# Altium project TMDX654GPEVM.PrjPcb (part 10 of 24)

## Sheet 26-XDS110 DEBUGGER.SchDoc
size 513 x 386 mm
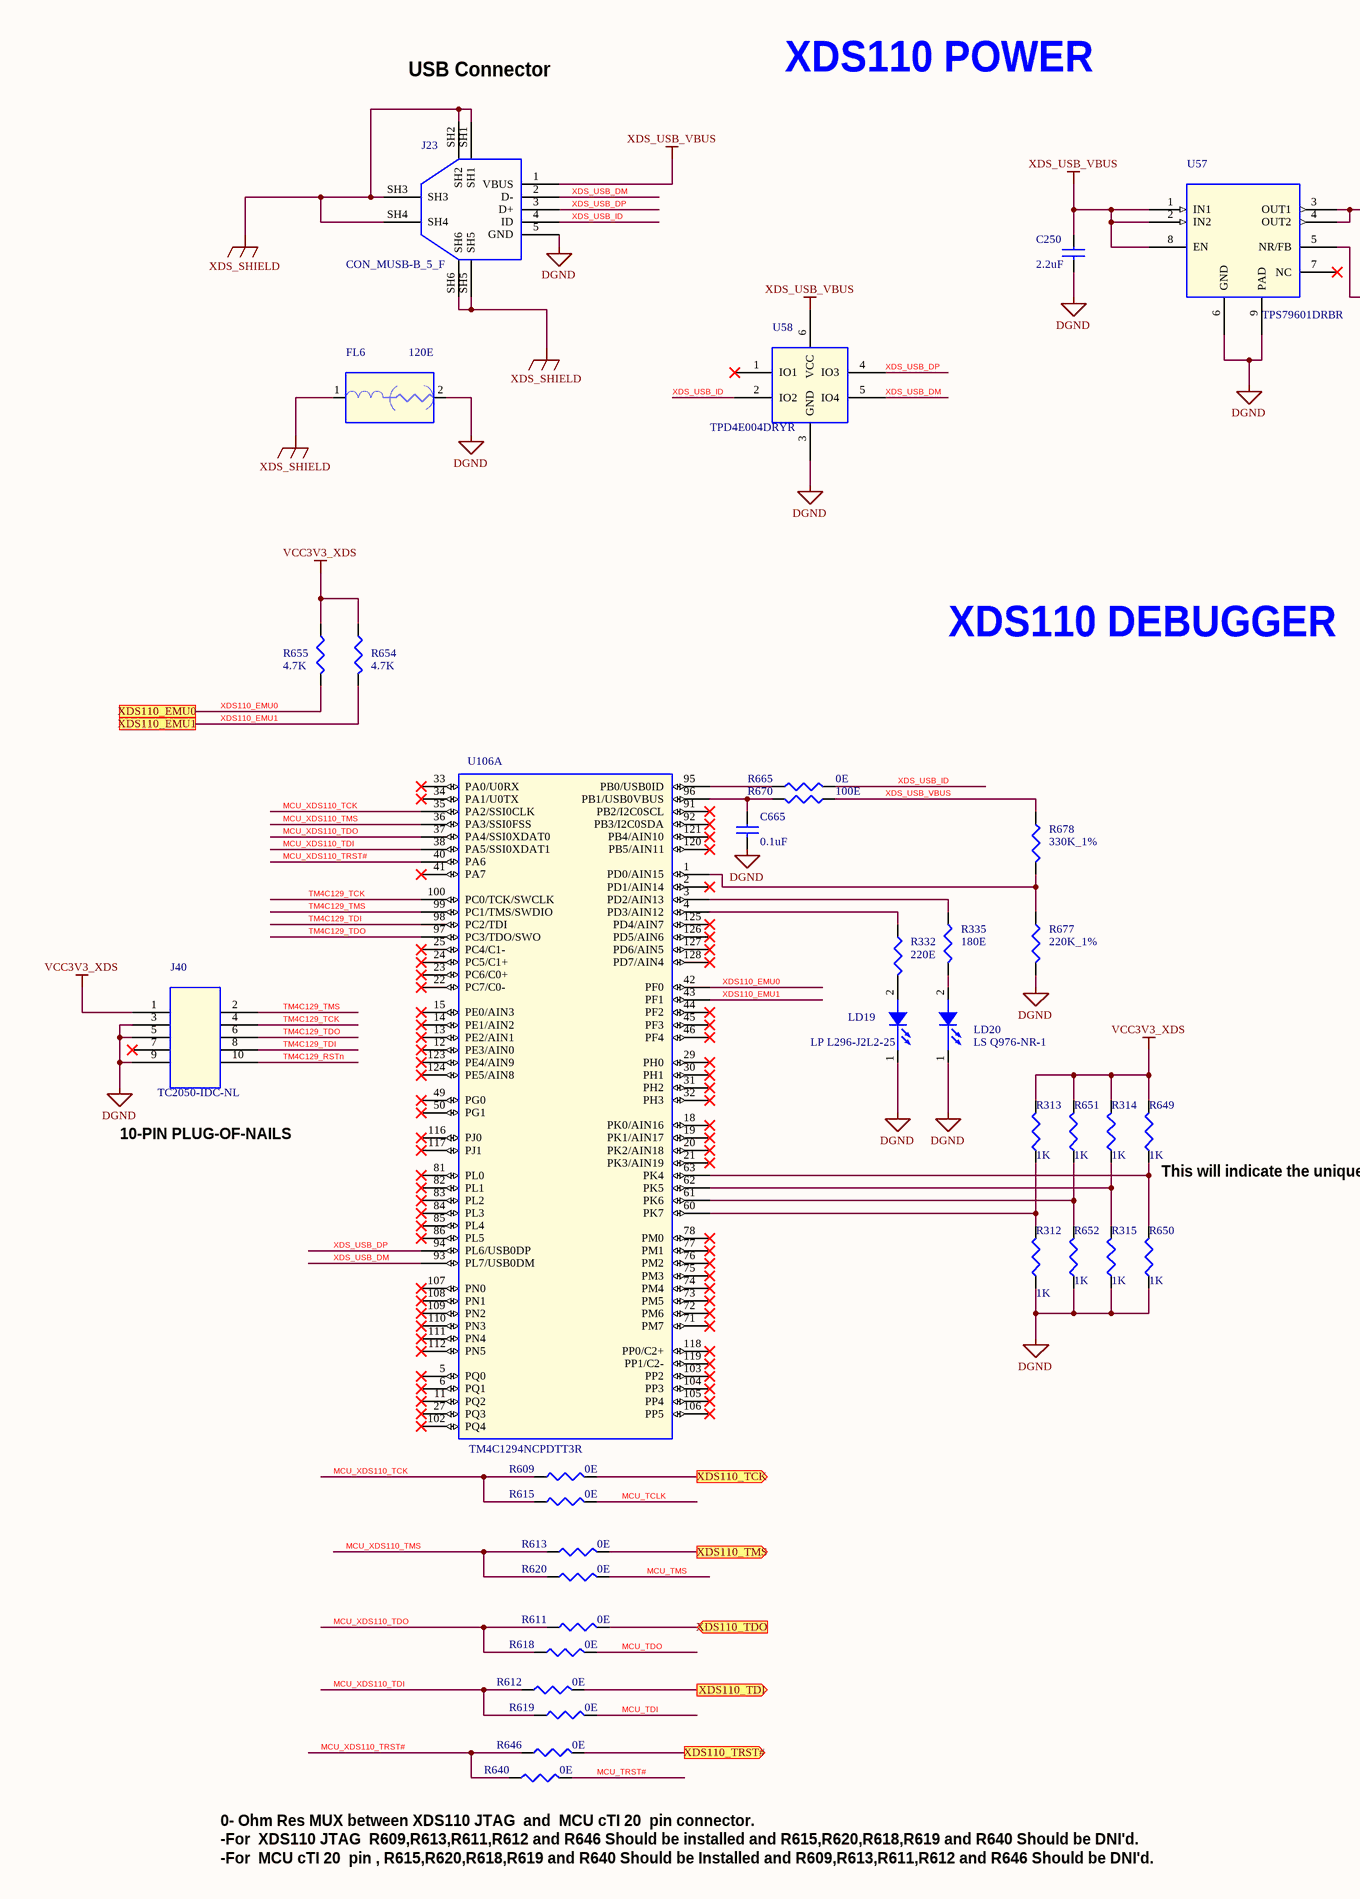
[diagram p44: 26-XDS110 DEBUGGER.SchDoc, left]
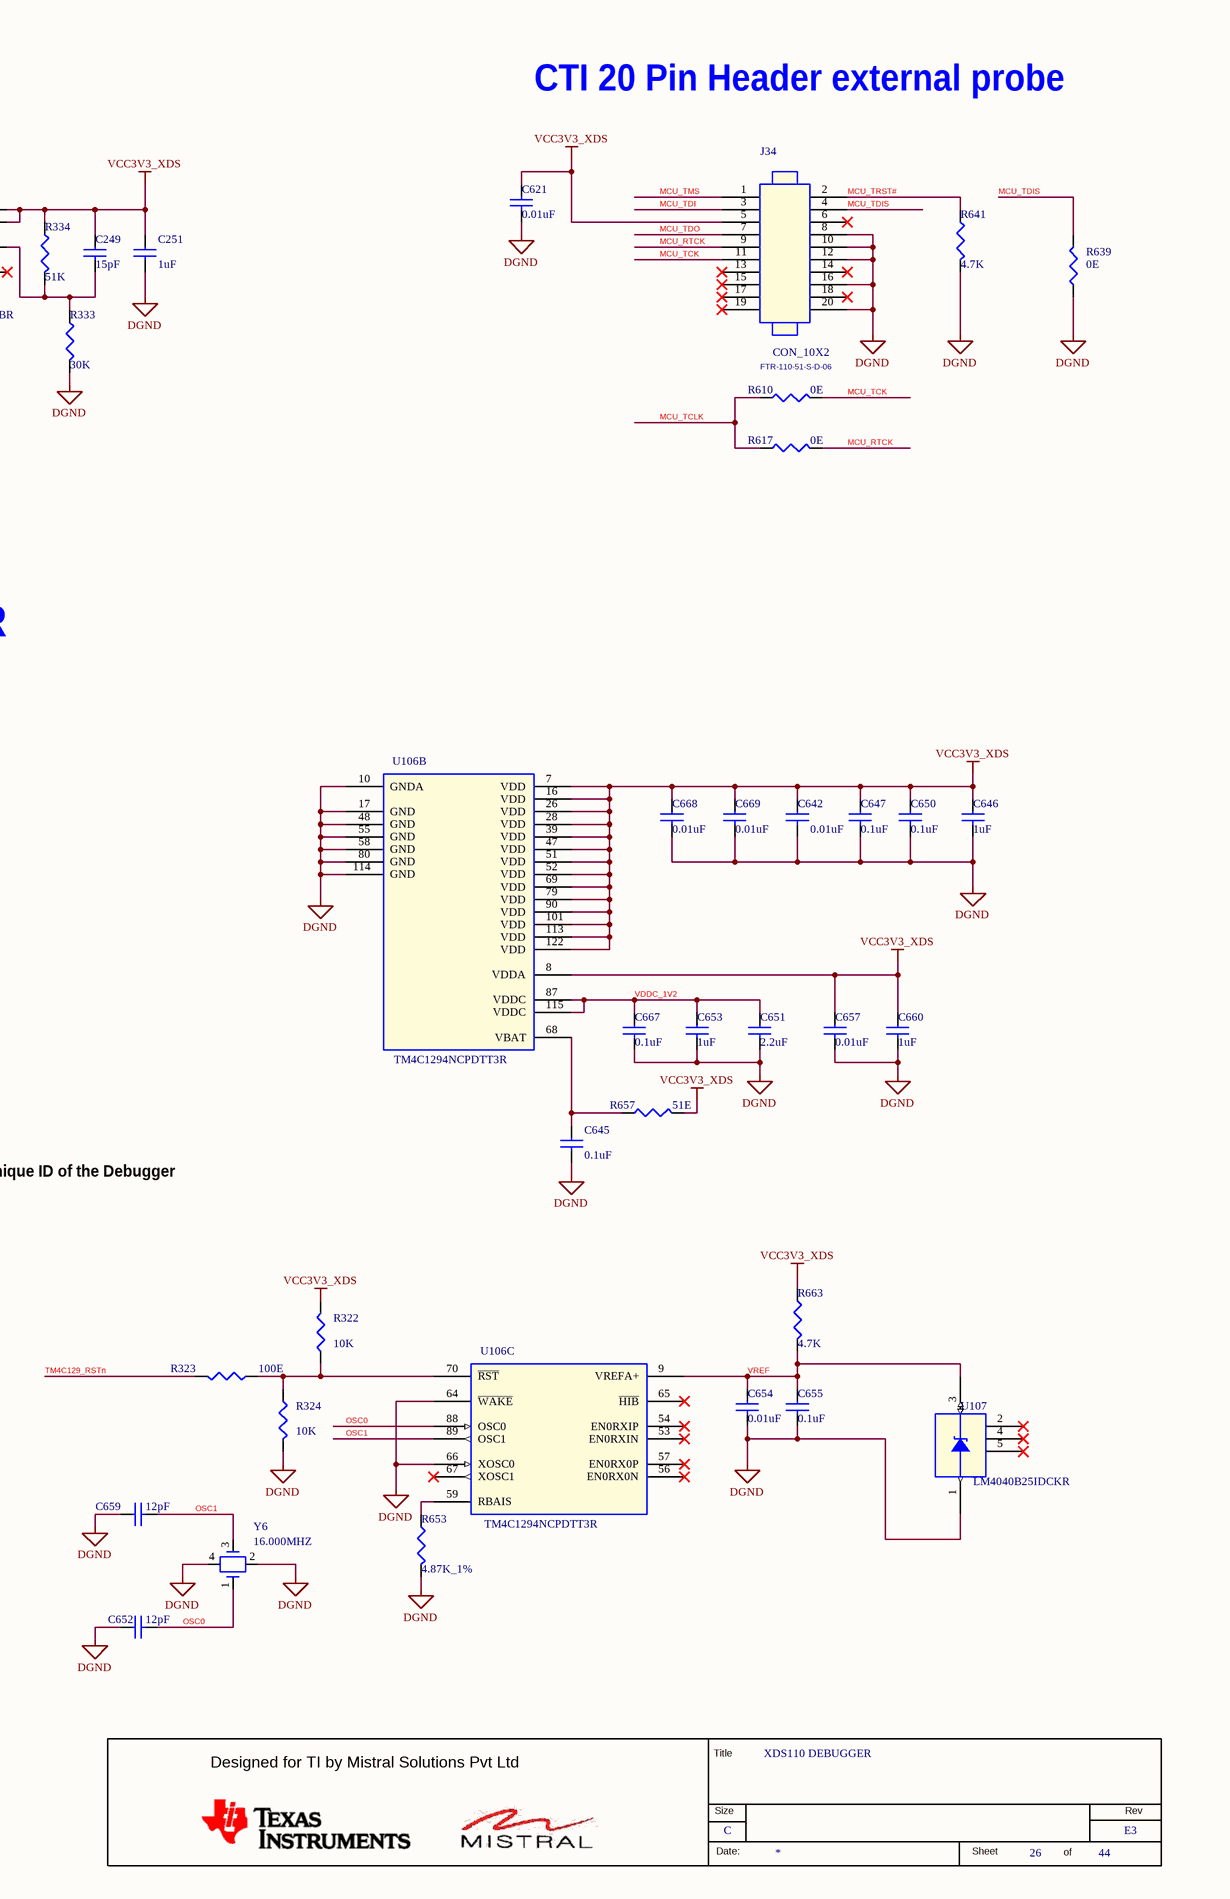
[diagram p45: 26-XDS110 DEBUGGER.SchDoc, right]

### Parts
(Parts that share a designator on the sheet are numbered #1, #2 ... from top to bottom, then left to right.)
*#26  RevCode: E3  Title: XDS110 DEBUGGER  Page Size: C  Page Number: 26  Page Count: 44  (hidden comment: MISTRAL_TITLEBLK_CSIZE)  (graphical)
C249  15pF  [CAP0402_0-75]
C250  2.2uF  [CAP0402_0-75]
C251  1uF  [CAP0402_0-75]
C621  0.01uF  [CAP0201_0-5]
C642  0.01uF  [CAP0201_0-5]
C645  0.1uF  [CAP0201_0-5]
C646  1uF  [CAP0402_0-75]
C647  0.1uF  [CAP0201_0-5]
C650  0.1uF  [CAP0201_0-5]
C651  2.2uF  [CAP0402_0-75]
C652  12pF  [CAP0402]
C653  1uF  [CAP0402_0-75]
C654  0.01uF  [CAP0201_0-5]
C655  0.1uF  [CAP0201_0-5]
C657  0.01uF  [CAP0201_0-5]
C659  12pF  [CAP0402]
C660  1uF  [CAP0402_0-75]
C665  0.1uF  [CAP0201_0-5]
C667  0.1uF  [CAP0201_0-5]
C668  0.01uF  [CAP0201_0-5]
C669  0.01uF  [CAP0201_0-5]
FL6  120E  [EMIFIL_BLM15A_0402_0-6]
J23  CON_MUSB-B_5_F  [CON_MUSBB5_1051640001_S_R_S_2-5]
J34  CON_10X2  Mfr_part_number: FTR-110-51-S-D-06  [CON_10X2_FTR-110-51-S-D_P_S_S]
J40  TC2050-IDC-NL  [CON_2X5_TC2050-IDC-430-NL_T]
LD19  LP L296-J2L2-25  [LED_0603_0-7]
LD20  LS Q976-NR-1  [LED_0603_0-8]
R312  1K  [RES0201]
R313  1K  [RES0201]
R314  1K  [RES0201]
R315  1K  [RES0201]
R322  10K  [RES0402_0-5]
R323  100E  [RES0402_0-5]
R324  10K  [RES0402_0-5]
R332  220E  [RES0402_0-5]
R333  30K  [RES0402_0-5]
R334  51K  [RES0402_0-5]
R335  180E  [RES0402]
R609  0E  [RES0402_0-5]
R610  0E  [RES0402_0-5]
R611  0E  [RES0402_0-5]
R612  0E  [RES0402_0-5]
R613  0E  [RES0402_0-5]
R615  0E  [RES0402_0-5]
R617  0E  [RES0402_0-5]
R618  0E  [RES0402_0-5]
R619  0E  [RES0402_0-5]
R620  0E  [RES0402_0-5]
R639  0E  [RES0402_0-5]
R640  0E  [RES0402_0-5]
R641  4.7K  [RES0402]
R646  0E  [RES0402_0-5]
R649  1K  [RES0201]
R650  1K  [RES0201]
R651  1K  [RES0201]
R652  1K  [RES0201]
R653  4.87K_1%  [RES0402]
R654  4.7K  [RES0402]
R655  4.7K  [RES0402]
R657  51E  [RES0402]
R663  4.7K  [RES0402]
R665  0E  [RES0402_0-5]
R670  100E  [RES0402_0-5]
R677  220K_1%  [RES0402_0-5]
R678  330K_1%  [RES0402_0-5]
U57  TPS79601DRBR  [SON8_25-59_130X130_1]
U58  TPD4E004DRYR  [SON6_19-68_60X45]
U106  TM4C1294NCPDTT3R  [TQFP128_15-74_550X550_1-2]  (parts A,B,C of 3)
U107  LM4040B25IDCKR  [SC70-5_1-1]
Y6  16.000MHZ  [XTAL4_NX3225GA_130X100_SMD_0-9]

### Ports
XDS110_EMU0, XDS110_EMU1, XDS110_TCK (out), XDS110_TDI (out), XDS110_TDO (in), XDS110_TMS (out), XDS110_TRST# (out)

### Nets
DGND: C250.2 C251.2 C621.2 C642.2 C645.2 C646.2 C647.2 C650.2 C651.2 C652.1 C653.2 C654.2 C655.2 C657.2 C659.1 C660.2 C665.2 C667.2 C668.2 C669.2 FL6.2 J23.5(GND) J34.8 J34.10 J34.12 J34.16 J34.20 J40.3 J40.5 J40.9 LD19.1(CATHODE) LD20.1(CATHODE) R312.1 R315.1 R324.2 R333.2 R639.1 R641.2 R650.1 R652.1 R653.2 R677.2 U57.6(GND) U57.9(PAD) U58.3(GND) U106.10(GNDA) U106.17(GND) U106.48(GND) U106.55(GND) U106.58(GND) U106.64(~{WAKE}) U106.66(XOSC0) U106.80(GND) U106.114(GND) U107.1(ANODE) Y6.2 Y6.4
VCC3V3_XDS: C249.1 C251.1 C621.1 C642.1 C646.1 C647.1 C650.1 C657.1 C660.1 C668.1 C669.1 J34.5 J40.1 R313.2 R314.2 R322.2 R334.1 R649.2 R651.2 R654.1 R655.1 R657.2 R663.1 U57.3(OUT1) U57.4(OUT2) U106.7(VDD) U106.8(VDDA) U106.16(VDD) U106.26(VDD) U106.28(VDD) U106.39(VDD) U106.47(VDD) U106.51(VDD) U106.52(VDD) U106.69(VDD) U106.79(VDD) U106.90(VDD) U106.101(VDD) U106.113(VDD) U106.122(VDD)
XDS_SHIELD: FL6.1 J23.SH1 J23.SH2 J23.SH3 J23.SH4 J23.SH5 J23.SH6
XDS_USB_VBUS: C250.1 J23.1(VBUS) R670.1 R678.1 U57.1(IN1) U57.2(IN2) U57.8(EN) U58.6(VCC)
MCU_RTCK: J34.9 R617.2
MCU_TCK: J34.11 R610.2
MCU_TCLK: R610.1 R615.2 R617.1
MCU_TDI: J34.3 R619.2
MCU_TDIS: J34.4 R639.2
MCU_TDO: J34.7 R618.2
MCU_TMS: J34.1 R620.2
MCU_TRST#: J34.2 R640.2 R641.1
MCU_XDS110_TCK: R609.1 R615.1 U106.35(PA2/SSI0CLK)
MCU_XDS110_TDI: R612.1 R619.1 U106.38(PA5/SSI0XDAT1)
MCU_XDS110_TDO: R611.1 R618.1 U106.37(PA4/SSI0XDAT0)
MCU_XDS110_TMS: R613.1 R620.1 U106.36(PA3/SSI0FSS)
MCU_XDS110_TRST#: R640.1 R646.1 U106.40(PA6)
OSC0: C652.2 U106.88(OSC0) Y6.1
OSC1: C659.2 U106.89(OSC1) Y6.3
TM4C129_RSTn: J40.10 R323.2
TM4C129_TCK: J40.4 U106.100(PC0/TCK/SWCLK)
TM4C129_TDI: J40.8 U106.98(PC2/TDI)
TM4C129_TDO: J40.6 U106.97(PC3/TDO/SWO)
TM4C129_TMS: J40.2 U106.99(PC1/TMS/SWDIO)
VDDC_1V2: C651.1 C653.1 C667.1 U106.87(VDDC) U106.115(VDDC)
VREF: C654.1 C655.1 R663.2 U106.9(VREFA+) U107.3(CATHODE)
XDS110_EMU0: R655.2 U106.42(PF0) ; port XDS110_EMU0
XDS110_EMU1: R654.2 U106.43(PF1) ; port XDS110_EMU1
XDS110_TCK: R609.2 ; port XDS110_TCK
XDS110_TDI: R612.2 ; port XDS110_TDI
XDS110_TDO: R611.2 ; port XDS110_TDO
XDS110_TMS: R613.2 ; port XDS110_TMS
XDS110_TRST#: R646.2 ; port XDS110_TRST#
XDS_USB_DM: J23.2(D-) U58.5(IO4) U106.93(PL7/USB0DM)
XDS_USB_DP: J23.3(D+) U58.4(IO3) U106.94(PL6/USB0DP)
XDS_USB_ID: J23.4(ID) R665.2 U58.2(IO2)
NetC249_2: C249.2 R333.1 R334.2 U57.5(NR/FB)
NetC645_1: C645.1 R657.1 U106.68(VBAT)
NetC665_1: C665.1 R670.2 U106.96(PB1/USB0VBUS)
NetLD19_2: LD19.2(ANODE) R332.2
NetLD20_2: LD20.2(ANODE) R335.2
NetR312_2: R312.2 R313.1 U106.60(PK7)
NetR314_1: R314.1 R315.2 U106.62(PK5)
NetR322_1: R322.1 R323.1 R324.1 U106.70(~{RST})
NetR332_1: R332.1 U106.4(PD3/AIN12)
NetR335_1: R335.1 U106.3(PD2/AIN13)
NetR649_1: R649.1 R650.2 U106.63(PK4)
NetR651_1: R651.1 R652.2 U106.61(PK6)
NetR653_1: R653.1 U106.59(RBAIS)
NetR665_1: R665.1 U106.95(PB0/USB0ID)
NetR677_1: R677.1 R678.2 U106.1(PD0/AIN15)

Not connected (* = marked no-connect by the designer): J34 6* 13* 14* 15* 17* 18* 19*; J40 7*; U57 7(NC)*; U58 1(IO1)*; U106 2(PD1/AIN14)* 5(PQ0)* 6(PQ1)* 11(PQ2)* 12(PE3/AIN0)* 13(PE2/AIN1)* 14(PE1/AIN2)* 15(PE0/AIN3)* 18(PK0/AIN16)* 19(PK1/AIN17)* 20(PK2/AIN18)* 21(PK3/AIN19)* 22(PC7/C0-)* 23(PC6/C0+)* 24(PC5/C1+)* 25(PC4/C1-)* 27(PQ3)* 29(PH0)* 30(PH1)* 31(PH2)* 32(PH3)* 33(PA0/U0RX)* 34(PA1/U0TX)* 41(PA7)* 44(PF2)* 45(PF3)* 46(PF4)* 49(PG0)* 50(PG1)* 53(EN0RXIN)* 54(EN0RXIP)* 56(EN0RX0N)* 57(EN0RX0P)* 65(~{HIB})* 67(XOSC1)* 71(PM7)* 72(PM6)* 73(PM5)* 74(PM4)* 75(PM3)* 76(PM2)* 77(PM1)* 78(PM0)* 81(PL0)* 82(PL1)* 83(PL2)* 84(PL3)* 85(PL4)* 86(PL5)* 91(PB2/I2C0SCL)* 92(PB3/I2C0SDA)* 102(PQ4)* 103(PP2)* 104(PP3)* 105(PP4)* 106(PP5)* 107(PN0)* 108(PN1)* 109(PN2)* 110(PN3)* 111(PN4)* 112(PN5)* 116(PJ0)* 117(PJ1)* 118(PP0/C2+)* 119(PP1/C2-)* 120(PB5/AIN11)* 121(PB4/AIN10)* 123(PE4/AIN9)* 124(PE5/AIN8)* 125(PD4/AIN7)* 126(PD5/AIN6)* 127(PD6/AIN5)* 128(PD7/AIN4)*; U107 2(NC1)* 4(NC2)* 5(NC3)*

### Notes on the sheet
- USB Connector
- XDS110 POWER
- CTI 20 Pin Header external probe
- XDS110 DEBUGGER
- 10-PIN PLUG-OF-NAILS
- (near R649) This will indicate the unique ID of the Debugger
- (near R640) 0- Ohm Res MUX between XDS110 JTAG  and  MCU cTI 20  pin connector.
  -For  XDS110 JTAG  R609,R613,R611,R612 and R646 Should be installed and R615,R620,R618,R619 and R640 Should be DNI'd.
  -For  MCU cTI 20  pin , R615,R620,R618,R619 and R640 Should be Installed and R609,R613,R611,R612 and R646 Should be DNI'd.
- (in symbol MISTRAL_TITLEBLK_CSIZE) Title; Designed for TI by Mistral Solutions Pvt Ltd; Size; Rev; Date:; Sheet; of

### Library data of the parts
*#26 = MISTRAL_TITLEBLK_CSIZE: Issue: 1.0; Page Create Date: March  8, 1995; Page Modify Date: *
C249 = CAP_Dup5: CAP CERAMIC 15pF 50V 5% C0G 0402; Mistral Part No: 120010040006-R; Mfr_name: MURATA; Mfr_part_number: GRM1555C1H150JA01D; Part_type: CAPACITORS\CERAMIC; Project: BUG_BASE-II; Wattage: NA; Customs_HS_Code: 85322990; Custom_Duty: 15%; PCB Footprint: CAP0402_0-75; Tolerance: 5%; Voltage: 50V; Package: 0402; Distributor_name: DIGIKEY; Distributor_part_number: 490-5888-1-ND; Height: 0.55MM; Weight: 0.3g; Temperature: -55°C+125°C; Datasheet: Y:\MIS_DATABASE\DATASHEETS\CAPACITORS\MURATA_CMCC.PDF; Crtd /date: MUDDU/290410; Chkd/date: VASANTHA/061216; MECHANICAL 3D STEP FILE: CAP0402_0-75; Library Ref: CAP
C250 C651 = CAP_Dup5: CAP CERAMIC 2.2uF 10V 20% X5R 0402; Mistral Part No: 120018010016-R; Mfr_name: MURATA; Mfr_part_number: GRT155R61A225ME01D; Part_type: CAPACITORS\CERAMIC; Project: TI_MAXIE_CPB; Wattage: NA; Customs_HS_Code: 85322990; Custom_Duty: 15%; Tolerance: 20%; Voltage: 10V; Package: 0402; Distributor_name: DIGIKEY; Distributor_part_number: 490-12254-1-ND; Height: 0.55MM; Weight: 0.65mg; Temperature: -55°C+85°C; Datasheet: Y:\MIS_DATABASE\DATASHEETS\CAPACITORS\GRT155R61A225ME01.PDF; Crtd /date: MANIRAJA/240118; Chkd/date: MANIRAJA/240118; MECHANICAL 3D STEP FILE: CAP0402_0-75; PCB Footprint: CAP0402_0-75; Library Ref: CAP
C251 C653 = CAP_Dup5: CAP CERAMIC 1uF 16V 20% X5R 0402; Part_type: CAPACITORS\CERAMIC; Mfr_part_number: EMK105BJ105MV-F; Mfr_name: TAIYO YUDEN; Mistral Part No: 120018020006-R; Custom_Duty: 15%; Customs_HS_Code: 85322990; Project: TI_MAXIE_CPB; Wattage: NA; Chkd/date: MANIRAJA/150218; Crtd /date: ALVY/150218; Datasheet: Y:\MIS_DATABASE\DATASHEETS\CAPACITORS\EMK105BJ105MV-F.PDF; Temperature: -55°C+85°C; Weight: 0.65mg; Height: 0.55MM; Distributor_part_number: 587-5514-1-ND; Distributor_name: DIGIKEY; Package: 0402; Voltage: 16V; Tolerance: 20%; PCB Footprint: CAP0402_0-75; MECHANICAL 3D STEP FILE: CAP0402_0-75; Library Path: Y:\MIS_DATABASE\Library\ALTIUM_TOOL\SCHEMATICS_PARTS\MS_DISCRETE_Library.schlib; Footprint Path: Y:\MIS_DATABASE\Library\ALTIUM_TOOL\PCB_FOOTPRINTS\Altium_Footprint_Lib.PcbLib; Library Ref: CAP; Footprint Ref: CAP0402_0-75
C621 = CAP_Dup4: CAP CERAMIC 0.01uF 25V 10% X5R 0201; Mistral Part No: 120018010007-R; Mfr_name: MURATA; Mfr_part_number: GRM033R61E103KA12J; Part_type: CAPACITORS\CERAMIC; Wattage: NA; Project: TI_MAXIE_CPB; Customs_HS_Code: 85322990; Custom_Duty: 15%; MECHANICAL 3D STEP FILE: CAP0201_0-5; Tolerance: 10%; Voltage: 25V; Package: 0201; Distributor_name: DIGIKEY; Distributor_part_number: GRM033R61E103KA12J-ND; Height: 0.33MM; Weight: 0.33mg; Temperature: -55°C+85°C; Datasheet: Y:\MIS_DATABASE\DATASHEETS\CAPACITORS\GRM033R61E103KA12.PDF; Crtd /date: MANIRAJA/230118; Chkd/date: MANIRAJA/230118; PCB Footprint: CAP0201_0-5; Library Ref: CAP
C642 C668 = CAP_Dup5: CAP CERAMIC 0.01uF 25V 10% X5R 0201; Mistral Part No: 120018010007-R; Mfr_name: MURATA; Mfr_part_number: GRM033R61E103KA12J; Part_type: CAPACITORS\CERAMIC; Project: TI_MAXIE_CPB; Wattage: NA; Customs_HS_Code: 85322990; Custom_Duty: 15%; PCB Footprint: CAP0201_0-5; Tolerance: 10%; Voltage: 25V; Package: 0201; Distributor_name: DIGIKEY; Distributor_part_number: GRM033R61E103KA12J-ND; Height: 0.33MM; Weight: 0.33mg; Temperature: -55°C+85°C; Datasheet: Y:\MIS_DATABASE\DATASHEETS\CAPACITORS\GRM033R61E103KA12.PDF; Crtd /date: MANIRAJA/230118; Chkd/date: MANIRAJA/230118; MECHANICAL 3D STEP FILE: CAP0201_0-5; Library Ref: CAP
C645 C647 C650 C665 = CAP_Dup5: as C613 on sheet 24-BOOT MODE BUFFER AND SWITCHES; PCB Footprint: CAP0201_0-5; MECHANICAL 3D STEP FILE: CAP0201_0-5; Chkd/date: MANIRAJA/120218; Crtd /date: MANIRAJA/120218; Datasheet: Y:\MIS_DATABASE\DATASHEETS\CAPACITORS\GRM033R61C104KE84.PDF; Temperature: -55°C+85°C; Weight: 0.33mg; Height: 0.33MM; Distributor_part_number: 490-16742-1-ND; Distributor_name: DIGIKEY; Package: 0201; Voltage: 16V; Tolerance: 10%; Library Ref: CAP
C646 C660 = CAP_Dup5: CAP CERAMIC 1uF 16V 20% X5R 0402; Mistral Part No: 120018020006-R; Mfr_name: TAIYO YUDEN; Mfr_part_number: EMK105BJ105MV-F; Part_type: CAPACITORS\CERAMIC; Project: TI_MAXIE_CPB; Customs_HS_Code: 85322990; Custom_Duty: 15%; Wattage: NA; Tolerance: 20%; Voltage: 16V; Package: 0402; Distributor_name: DIGIKEY; Distributor_part_number: 587-5514-1-ND; Height: 0.55MM; Weight: 0.65mg; Temperature: -55°C+85°C; Datasheet: Y:\MIS_DATABASE\DATASHEETS\CAPACITORS\EMK105BJ105MV-F.PDF; Crtd /date: ALVY/150218; Chkd/date: MANIRAJA/150218; PCB Footprint: CAP0402_0-75; MECHANICAL 3D STEP FILE: CAP0402_0-75; Library Path: Y:\MIS_DATABASE\Library\ALTIUM_TOOL\SCHEMATICS_PARTS\MS_DISCRETE_Library.schlib; Footprint Path: Y:\MIS_DATABASE\Library\ALTIUM_TOOL\PCB_FOOTPRINTS\Altium_Footprint_Lib.PcbLib; Library Ref: CAP; Footprint Ref: CAP0402_0-75
C652 = CAP_Dup5: CAP CERAMIC 12pF 50V 5% C0G 0402; Mistral Part No: 120015110024-R; Mfr_name: MURATA; Mfr_part_number: GRM1555C1H120JA01D; Part_type: CAPACITORS\CERAMIC; Project: TI_C5545; Wattage: NA; Customs_HS_Code: 85322990; Custom_Duty: 15%; PCB Footprint: CAP0402; Tolerance: 5%; Voltage: 50V; Package: 0402; Distributor_name: DIGIKEY; Distributor_part_number: 490-5924-1-ND; Height: 0.55MM; Weight: NA; Temperature: -55°C+125°C; Datasheet: Y:\MIS_DATABASE\DATASHEETS\CAPACITORS\GRM188SERIES.PDF; Crtd /date: VASANTHA/271115; Chkd/date: VASANTHA/271115; Library Ref: CAP; Footprint Ref: CAP0402; Library Path: Y:\MIS_DATABASE\Library\ALTIUM_TOOL\SCHEMATICS_PARTS\MS_DISCRETE_Library.schlib; Footprint Path: Y:\MIS_DATABASE\Library\ALTIUM_TOOL\PCB_FOOTPRINTS\Altium_Footprint_Lib.PcbLib
C654 C657 C669 = CAP_Dup5: CAP CERAMIC 0.01uF 25V 10% X5R 0201; Part_type: CAPACITORS\CERAMIC; Mfr_part_number: GRM033R61E103KA12J; Mfr_name: MURATA; Mistral Part No: 120018010007-R; Custom_Duty: 15%; Customs_HS_Code: 85322990; Wattage: NA; Project: TI_MAXIE_CPB; PCB Footprint: CAP0201_0-5; MECHANICAL 3D STEP FILE: CAP0201_0-5; Chkd/date: MANIRAJA/230118; Crtd /date: MANIRAJA/230118; Datasheet: Y:\MIS_DATABASE\DATASHEETS\CAPACITORS\GRM033R61E103KA12.PDF; Temperature: -55°C+85°C; Weight: 0.33mg; Height: 0.33MM; Distributor_part_number: GRM033R61E103KA12J-ND; Distributor_name: DIGIKEY; Package: 0201; Voltage: 25V; Tolerance: 10%; Library Ref: CAP
C655 C667 = CAP_Dup5: as C614 on sheet 24-BOOT MODE BUFFER AND SWITCHES; PCB Footprint: CAP0201_0-5; Tolerance: 10%; Voltage: 16V; Package: 0201; Distributor_name: DIGIKEY; Distributor_part_number: 490-16742-1-ND; Height: 0.33MM; Weight: 0.33mg; Temperature: -55°C+85°C; Datasheet: Y:\MIS_DATABASE\DATASHEETS\CAPACITORS\GRM033R61C104KE84.PDF; Crtd /date: MANIRAJA/120218; Chkd/date: MANIRAJA/120218; MECHANICAL 3D STEP FILE: CAP0201_0-5; Library Ref: CAP
C659 = CAP_Dup5: CAP CERAMIC 12pF 50V 5% C0G 0402; Part_type: CAPACITORS\CERAMIC; Mfr_part_number: GRM1555C1H120JA01D; Mfr_name: MURATA; Mistral Part No: 120015110024-R; Custom_Duty: 15%; Customs_HS_Code: 85322990; Wattage: NA; Project: TI_C5545; PCB Footprint: CAP0402; Chkd/date: VASANTHA/271115; Crtd /date: VASANTHA/271115; Datasheet: Y:\MIS_DATABASE\DATASHEETS\CAPACITORS\GRM188SERIES.PDF; Temperature: -55°C+125°C; Weight: NA; Height: 0.55MM; Distributor_part_number: 490-5924-1-ND; Distributor_name: DIGIKEY; Package: 0402; Voltage: 50V; Tolerance: 5%; Library Ref: CAP; Footprint Ref: CAP0402; Library Path: Y:\MIS_DATABASE\Library\ALTIUM_TOOL\SCHEMATICS_PARTS\MS_DISCRETE_Library.schlib; Footprint Path: Y:\MIS_DATABASE\Library\ALTIUM_TOOL\PCB_FOOTPRINTS\Altium_Footprint_Lib.PcbLib
FL6 = EMIFILTER_IND: FERRITE CHIP 120E 1.3A 0402; Mistral Part No: 130012030043-R; Mfr_name: MURATA; Mfr_part_number: BLM15PD121SN1; Part_type: MISC\FILTER; Project: GEN_3-8; Tolerance: 25%; Voltage: NA; Customs_HS_Code: 85437099; Custom_Duty: 24%; PCB Footprint: EMIFIL_BLM15A_0402_0-6; Wattage: NA; Package: 0402; Distributor_name: DIGIKEY; Distributor_part_number: 490-5203-1-ND; Height: 0.55MM; Weight: 0.65mg; Temperature: -55°C+125°C; Datasheet: Y:\MIS_DATABASE\DATASHEETS\DISCRETES\INDUCTORS\BLM18K-SERIES.PDF; Crtd /date: CHAITHANYA/150312; Chkd/date: VASANTHA/010117; MECHANICAL 3D STEP FILE: EMIFIL_BLM15A_0402_0-6; Library Ref: EMIFILTER_IND; Footprint Ref: EMIFIL_BLM15A_0402_0-6; Library Path: Y:\MIS_DATABASE\Library\ALTIUM_TOOL\SCHEMATICS_PARTS\MS_FILTER_Library.schlib; Footprint Path: Y:\MIS_DATABASE\Library\ALTIUM_TOOL\PCB_FOOTPRINTS\Altium_Footprint_Lib.PcbLib
J23 = CON_MUSB-B_5_1051640001: CON MICRO USB-B TYPE 5POS FEMALE RT SMD; Mistral Part No: 150017080018-R; Mfr_name: MOLEX; Part_type: CONNECTOR\USB; Project: TI_MAXIE_CPB; Tolerance: NA; Customs_HS_Code: 85369090; Custom_Duty: 24%; PCB Footprint: CON_MUSBB5_1051640001_S_R_S_2-5; Mfr_part_number: 1051640001; Voltage: NA; Wattage: NA; Package: SMD; Distributor_name: DIGIKEY; Distributor_part_number: WM11263CT-ND; Height: 2.45MM; Weight: 234mg; Temperature: -35°C+85°C; Datasheet: Y:\MIS_DATABASE\DATASHEETS\CONNECTORS\1051640001.PDF; Crtd /date: MANIRAJA/230817; Chkd/date: MANIRAJA/230817; MECHANICAL 3D STEP FILE: CON_MUSBB5_1051640001_S_R_S_2-5; Library Ref: CON_MUSB-B_5_1051640001
J34 = CON_10X2: CON 10X2 1.27MM PITCH MALE SMD; Mistral Part No: 150011090001-R; Mfr_name: SAMTEC; Part_type: CONNECTOR\MISCELLANEOUS; Project: GEMYC; Tolerance: NA; Customs_HS_Code: 85369090; Custom_Duty: 24%; NI_MARK: DNI; Voltage: NA; Wattage: NA; Package: SMD; Distributor_name: DIGIKEY; Distributor_part_number: FTR-110-51-S-D-06-ND; Height: 7.37MM; Weight: NA; Temperature: -55°C+105°C; Datasheet: Y:\MIS_DATABASE\DATASHEETS\CONNECTORS\FTR-SERIES1.PDF; Crtd /date: CHAITHANYA/050811; Chkd/date: BAVISH/050911; PCB Footprint: CON_10X2_FTR-110-51-S-D_P_S_S; Library Ref: CON_10X2
J40 = CON_5X2: ACCESSORIE CABLE TAG CONNECT IN CIRCUIT 10POS WITH IDC CONNECTOR; Part_type: CABLE\ACCESSORIES; Mistral Part No: 170015120001; Wattage: NA; Project: ADI_SMLT; NI_MARK: DNI; Chkd/date: VASANTHA/031215; Crtd /date: VASANTHA/031215; Datasheet: Y:\MIS_DATABASE\DATASHEETS\MISC\ACCESSORIES\TC2050-IDC-NL.PDF; Temperature: NA; Weight: NA; Height: NA; Distributor_part_number: NA; Distributor_name: NA; Package: NA; Voltage: NA; Tolerance: NA; Mfr_part_number: TC2050-IDC-NL; Mfr_name: TAG CONNECT; PCB Footprint: CON_2X5_TC2050-IDC-430-NL_T; Library Ref: CON_5X2
LD19 = DIODE_LED: LED PURE GREEN 0603; Mistral Part No: 130017080025-R; Mfr_name: OSRAM; Mfr_part_number: LP L296-J2L2-25-Z; Part_type: OPTO\LED; Project: TI_MAXIE_CPB; Tolerance: NA; Customs_HS_Code: 85437099; Custom_Duty: 24%; Voltage: NA; Wattage: NA; Package: 0603; Distributor_name: DIGIKEY; Distributor_part_number: 475-2920-1-ND; Height: 0.67MM; Weight: 2mg; Temperature: -40°C+100°C; Datasheet: Y:\MIS_DATABASE\DATASHEETS\DISCRETES\LEDS\LPL296-J2L2-25.PDF; Crtd /date: MANIRAJA/230817; Chkd/date: MANIRAJA/230817; MECHANICAL 3D STEP FILE: LED_0603_0-7; PCB Footprint: LED_0603_0-7; Footprint Path: Y:\MIS_DATABASE\Library\ALTIUM_TOOL\PCB_FOOTPRINTS\Altium_Footprint_Lib.PcbLib; Library Ref: DIODE_LED
LD20 = DIODE_LED: LED SUPER RED 0603; Part_type: OPTO\LED; Mfr_name: OSRAM; Mistral Part No: 130018020039-R; Custom_Duty: 24%; Customs_HS_Code: 85437099; Wattage: NA; Project: TI_MAXIE_CPB; MECHANICAL 3D STEP FILE: LED_0603_0-8; Chkd/date: MANIRAJA/150218; Crtd /date: ALVY/150218; Datasheet: Y:\MIS_DATABASE\DATASHEETS\DISCRETES\LEDS\LSQ976-NR-1.PDF; Temperature: -30°C+85°C; Weight: 1.4mg; Height: 0.80MM; Distributor_part_number: 475-2512-1-ND; Distributor_name: DIGIKEY; Package: 0603; Voltage: NA; Tolerance: NA; Mfr_part_number: LS Q976-NR-1; PCB Footprint: LED_0603_0-8; Library Path: Y:\MIS_DATABASE\Library\ALTIUM_TOOL\SCHEMATICS_PARTS\MS_OPTO_Library.schlib; Footprint Path: Y:\MIS_DATABASE\Library\ALTIUM_TOOL\PCB_FOOTPRINTS\Altium_Footprint_Lib.PcbLib; Library Ref: DIODE_LED; Footprint Ref: LED_0603_0-8
R312 R650 = RESISTOR_Dup4: as R232 on sheet 24-BOOT MODE BUFFER AND SWITCHES; Tolerance: 5%; Wattage: 1/20W; Package: 0201; Distributor_name: DIGIKEY; Distributor_part_number: 541-1.00KAABCT-ND; Height: 0.28MM; Weight: NA; Temperature: -55°C+155°C; Datasheet: Y:\MIS_DATABASE\DATASHEETS\RESISTORS\CRCW0201.PDF; Crtd /date: JEBRAN/110815; Chkd/date: JEBRAN/110815; PCB Footprint: RES0201; Library Ref: RESISTOR
R313 R649 R651 = RESISTOR_Dup4: as R231 on sheet 24-BOOT MODE BUFFER AND SWITCHES; Chkd/date: JEBRAN/110815; Crtd /date: JEBRAN/110815; Datasheet: Y:\MIS_DATABASE\DATASHEETS\RESISTORS\CRCW0201.PDF; Temperature: -55°C+155°C; Weight: NA; Height: 0.28MM; Distributor_part_number: 541-1.00KAABCT-ND; Distributor_name: DIGIKEY; Package: 0201; Wattage: 1/20W; Tolerance: 5%; PCB Footprint: RES0201; Library Ref: RESISTOR
R314 = RESISTOR_Dup4: as R239 on sheet 24-BOOT MODE BUFFER AND SWITCHES; Tolerance: 5%; Wattage: 1/20W; Package: 0201; Distributor_name: DIGIKEY; Distributor_part_number: 541-1.00KAABCT-ND; Height: 0.28MM; Weight: NA; Temperature: -55°C+155°C; Datasheet: Y:\MIS_DATABASE\DATASHEETS\RESISTORS\CRCW0201.PDF; Crtd /date: JEBRAN/110815; Chkd/date: JEBRAN/110815; PCB Footprint: RES0201; Library Ref: RESISTOR
R315 R652 = RESISTOR_Dup4: RES 1K 1/20W 5% 0201; Part_type: RESISTORS\FIXED; Mfr_part_number: CRCW02011K00FKED; Mfr_name: VISHAY; Mistral Part No: 110015080014-R; Custom_Duty: 15%; Customs_HS_Code: 85332119; Voltage: NA; Project: OCTASIC_3000; NI_MARK: DNI; Chkd/date: JEBRAN/110815; Crtd /date: JEBRAN/110815; Datasheet: Y:\MIS_DATABASE\DATASHEETS\RESISTORS\CRCW0201.PDF; Temperature: -55°C+155°C; Weight: NA; Height: 0.28MM; Distributor_part_number: 541-1.00KAABCT-ND; Distributor_name: DIGIKEY; Package: 0201; Wattage: 1/20W; Tolerance: 5%; PCB Footprint: RES0201; Library Ref: RESISTOR
R322 = RESISTOR_Dup5: as R66 on sheet 24-BOOT MODE BUFFER AND SWITCHES; PCB Footprint: RES0402_0-5; MECHANICAL 3D STEP FILE: RES0402_0-5; RoHS: Pb-Free; Chkd/date: VASANTHA/061216; Crtd /date: MAZHAR/230805; Datasheet: Y:\MIS_DATABASE\DATASHEETS\RESISTORS\YAGEO-RC0402.PDF; Temperature: -55°C+155°C; Weight: 0.65mg; Height: 0.40MM; Distributor_part_number: 311-10KJRCT-ND; Distributor_name: DIGIKEY; Package: 0402; Wattage: 1/16W; Tolerance: 5%; Library Ref: RESISTOR; Footprint Ref: RES0402_0-5; Library Path: Y:\MIS_DATABASE\Library\ALTIUM_TOOL\SCHEMATICS_PARTS\MS_DISCRETE_Library.schlib; Footprint Path: Y:\MIS_DATABASE\Library\ALTIUM_TOOL\PCB_FOOTPRINTS\Altium_Footprint_Lib.PcbLib
R323 R670 = RESISTOR_Dup5: RES 100E 1/16W 5% 0402; Part_type: RESISTORS\FIXED; Mfr_part_number: CRCW0402100RJNED; Mfr_name: VISHAY; Mistral Part No: 110009030164-R; Custom_Duty: 15%; Customs_HS_Code: 85332119; Voltage: NA; Project: TI_MAXIE_CPB; PCB Footprint: RES0402_0-5; MECHANICAL 3D STEP FILE: RES0402_0-5; Chkd/date: MANIRAJA/230817; Crtd /date: MANIRAJA/230817; Datasheet: Y:\MIS_DATABASE\DATASHEETS\RESISTORS\CRCW0603.PDF; Temperature: -55°C+155°C; Weight: 0.65mg; Height: 0.40MM; Distributor_part_number: 541-100JCT-ND; Distributor_name: DIGIKEY; Package: 0402; Wattage: 1/16W; Tolerance: 5%; Library Ref: RESISTOR
R324 = RESISTOR_Dup5: as R81 on sheet 24-BOOT MODE BUFFER AND SWITCHES; Tolerance: 5%; Wattage: 1/16W; Package: 0402; Distributor_name: DIGIKEY; Distributor_part_number: 311-10KJRCT-ND; Height: 0.40MM; Weight: 0.65mg; Temperature: -55°C+155°C; Datasheet: Y:\MIS_DATABASE\DATASHEETS\RESISTORS\YAGEO-RC0402.PDF; Crtd /date: MAZHAR/230805; Chkd/date: VASANTHA/061216; RoHS: Pb-Free; MECHANICAL 3D STEP FILE: RES0402_0-5; PCB Footprint: RES0402_0-5; Library Ref: RESISTOR; Footprint Ref: RES0402_0-5; Library Path: Y:\MIS_DATABASE\Library\ALTIUM_TOOL\SCHEMATICS_PARTS\MS_DISCRETE_Library.schlib; Footprint Path: Y:\MIS_DATABASE\Library\ALTIUM_TOOL\PCB_FOOTPRINTS\Altium_Footprint_Lib.PcbLib
R332 = RESISTOR_Dup5: RES 220E 1/16W 5% 0402; Part_type: RESISTORS\FIXED; Mfr_part_number: ERJ-2GEJ221X; Mfr_name: PANASONIC-ECG; Mistral Part No: 110009030506-R; Voltage: NA; Custom_Duty: 15%; Customs_HS_Code: 85332119; Project: RED EYE; Footprint Path: Y:\MIS_DATABASE\Library\ALTIUM_TOOL\PCB_FOOTPRINTS\Altium_Footprint_Lib.PcbLib; Library Path: Y:\MIS_DATABASE\Library\ALTIUM_TOOL\SCHEMATICS_PARTS\MS_DISCRETE_Library.schlib; MECHANICAL 3D STEP FILE: RES0402_0-5; Temperature: -55°C+155°C; Weight: 0.8g/1000pcs; PCB Footprint: RES0402_0-5; Chkd/date: VASANTHA/291216; Crtd /date: GEETHA/260406; Datasheet: Y:\MIS_DATABASE\DATASHEETS\RESISTORS\ERJ12.PDF; Height: 0.40MM; Distributor_part_number: P220JCT-ND; Distributor_name: DIGIKEY; Package: 0402; Wattage: 1/16W; Tolerance: 5%; Library Ref: RESISTOR
R333 = RESISTOR_Dup5: RES 30K 1/16W 5% 0402; Mistral Part No: 110017080023-R; Mfr_name: VISHAY; Mfr_part_number: CRCW040230K0JNED; Part_type: RESISTORS\FIXED; Project: TI_MAXIE_CPB; Voltage: NA; Customs_HS_Code: 85332119; Custom_Duty: 15%; PCB Footprint: RES0402_0-5; Tolerance: 5%; Wattage: 1/16W; Package: 0402; Distributor_name: DIGIKEY; Distributor_part_number: 541-30KJCT-ND; Height: 0.40MM; Weight: 0.65mg; Temperature: -55°C+155°C; Datasheet: Y:\MIS_DATABASE\DATASHEETS\RESISTORS\CRCW0603.PDF; Crtd /date: MANIRAJA/230817; Chkd/date: MANIRAJA/230817; MECHANICAL 3D STEP FILE: RES0402_0-5; Library Ref: RESISTOR
R334 = RESISTOR_Dup5: RES 51K 1/16W 5% 0402; Mistral Part No: 110009030966-R; Mfr_name: VISHAY; Mfr_part_number: CRCW040251K0JNED; Part_type: RESISTORS\FIXED; Project: TI_MAXIE_CPB; Voltage: NA; Customs_HS_Code: 85332119; Custom_Duty: 15%; Tolerance: 5%; Wattage: 1/16W; Package: 0402; Distributor_name: DIGIKEY; Distributor_part_number: 541-51KJCT-ND; Height: 0.40MM; Weight: 0.65mg; Temperature: -55°C+155°C; Datasheet: Y:\MIS_DATABASE\DATASHEETS\RESISTORS\CRCW0603.PDF; Crtd /date: MANIRAJA/230817; Chkd/date: MANIRAJA/230817; MECHANICAL 3D STEP FILE: RES0402_0-5; PCB Footprint: RES0402_0-5; Library Ref: RESISTOR
R335 = RESISTOR_Dup5: RES 180E 1/16W 5% 0402; Mistral Part No: 110009030371-R; Mfr_name: PANASONIC-ECG; Mfr_part_number: ERJ-2GEJ181X; Part_type: RESISTORS\FIXED; Project: RED EYE; Customs_HS_Code: 85332119; Custom_Duty: 15%; Voltage: NA; Tolerance: 5%; Wattage: 1/16W; Package: 0402; Distributor_name: DIGIKEY; Distributor_part_number: P180JCT-ND; Height: 0.40MM; Datasheet: Y:\MIS_DATABASE\DATASHEETS\RESISTORS\ERJ12.PDF; Crtd /date: GEETHA/280406; Chkd/date: MAZHAR/150709; PCB Footprint: RES0402; Library Ref: RESISTOR; Footprint Ref: RES0402; Weight: 0.8mg; Temperature: -55°C+155°C; Library Path: Y:\MIS_DATABASE\Library\ALTIUM_TOOL\SCHEMATICS_PARTS\MS_DISCRETE_Library.schlib; Footprint Path: Y:\MIS_DATABASE\Library\ALTIUM_TOOL\PCB_FOOTPRINTS\Altium_Footprint_Lib.PcbLib
R609 R610 = RESISTOR_Dup4: as R326 on sheet 25-CURRENT MONITORING DEVICES; RoHS: Pb-Free; Chkd/date: VASANTHA/201216; Crtd /date: MUDDU/190810; Datasheet: Y:\MIS_DATABASE\DATASHEETS\RESISTORS\CRCW0603.PDF; Temperature: -55°C+155°C; Weight: 0.65g/1000pcs; Height: 0.40MM; Distributor_part_number: 541-0.0JCT-ND; Distributor_name: DIGIKEY; Package: 0402; Wattage: 1/16W; Tolerance: NA; MECHANICAL 3D STEP FILE: RES0402_0-5; PCB Footprint: RES0402_0-5; Library Ref: RESISTOR; Footprint Ref: RES0402_0-5; Library Path: Y:\MIS_DATABASE\Library\ALTIUM_TOOL\SCHEMATICS_PARTS\MS_DISCRETE_Library.schlib; Footprint Path: Y:\MIS_DATABASE\Library\ALTIUM_TOOL\PCB_FOOTPRINTS\Altium_Footprint_Lib.PcbLib
R611-R613 R617 R639 R646 = RESISTOR_Dup4: as R325 on sheet 25-CURRENT MONITORING DEVICES; MECHANICAL 3D STEP FILE: RES0402_0-5; Voltage: NA; Wattage: 1/16W; Package: 0402; Distributor_name: DIGIKEY; Distributor_part_number: 541-0.0JCT-ND; Height: 0.40MM; Weight: 0.65g/1000pcs; Temperature: -55°C+155°C; Datasheet: Y:\MIS_DATABASE\DATASHEETS\RESISTORS\CRCW0603.PDF; Crtd /date: MUDDU/190810; Chkd/date: VASANTHA/201216; RoHS: Pb-Free; PCB Footprint: RES0402_0-5; Library Ref: RESISTOR; Footprint Ref: RES0402_0-5; Library Path: Y:\MIS_DATABASE\Library\ALTIUM_TOOL\SCHEMATICS_PARTS\MS_DISCRETE_Library.schlib; Footprint Path: Y:\MIS_DATABASE\Library\ALTIUM_TOOL\PCB_FOOTPRINTS\Altium_Footprint_Lib.PcbLib
R615 R618 R640 R665 = RESISTOR_Dup4: as R14 on sheet 25-CURRENT MONITORING DEVICES; MECHANICAL 3D STEP FILE: RES0402_0-5; RoHS: Pb-Free; Chkd/date: VASANTHA/201216; Crtd /date: MUDDU/190810; Datasheet: Y:\MIS_DATABASE\DATASHEETS\RESISTORS\CRCW0603.PDF; Temperature: -55°C+155°C; Weight: 0.65g/1000pcs; Height: 0.40MM; Distributor_part_number: 541-0.0JCT-ND; Distributor_name: DIGIKEY; Package: 0402; Wattage: 1/16W; Tolerance: NA; PCB Footprint: RES0402_0-5; Library Ref: RESISTOR; Footprint Ref: RES0402_0-5; Library Path: Y:\MIS_DATABASE\Library\ALTIUM_TOOL\SCHEMATICS_PARTS\MS_DISCRETE_Library.schlib; Footprint Path: Y:\MIS_DATABASE\Library\ALTIUM_TOOL\PCB_FOOTPRINTS\Altium_Footprint_Lib.PcbLib
R619 R620 = RESISTOR_Dup4: as R18 on sheet 25-CURRENT MONITORING DEVICES; Voltage: NA; Wattage: 1/16W; Package: 0402; Distributor_name: DIGIKEY; Distributor_part_number: 541-0.0JCT-ND; Height: 0.40MM; Weight: 0.65g/1000pcs; Temperature: -55°C+155°C; Datasheet: Y:\MIS_DATABASE\DATASHEETS\RESISTORS\CRCW0603.PDF; Crtd /date: MUDDU/190810; Chkd/date: VASANTHA/201216; RoHS: Pb-Free; MECHANICAL 3D STEP FILE: RES0402_0-5; PCB Footprint: RES0402_0-5; Library Ref: RESISTOR; Footprint Ref: RES0402_0-5; Library Path: Y:\MIS_DATABASE\Library\ALTIUM_TOOL\SCHEMATICS_PARTS\MS_DISCRETE_Library.schlib; Footprint Path: Y:\MIS_DATABASE\Library\ALTIUM_TOOL\PCB_FOOTPRINTS\Altium_Footprint_Lib.PcbLib
R641 R655 R663 = RESISTOR_Dup3: RES 4.7K 1/16W 5% 0402; Mistral Part No: 110009030792-R; Mfr_name: YAGEO AMERICA; Mfr_part_number: RC0402JR-074K7L; Part_type: RESISTORS\FIXED; Project: TMDXCSK368; Voltage: NA; Customs_HS_Code: 85332119; Custom_Duty: 15%; Tolerance: 5%; Wattage: 1/16W; Package: 0402; Distributor_name: DIGIKEY; Distributor_part_number: 311-4.7KJRCT-ND; Height: 0.55MM; Weight: NA; Temperature: -55°C+155°C; Datasheet: Y:\MIS_DATABASE\DATASHEETS\RESISTORS\YAGEO-RC0402.PDF; Crtd /date: VASANTHA/130516; Chkd/date: VASANTHA/130516; PCB Footprint: RES0402; Library Ref: RESISTOR
R653 = RESISTOR_Dup5: RES 4.87K 1/16W 1% 0402; Mistral Part No: 110009030803-R; Mfr_name: PANASONIC-ECG; Mfr_part_number: ERJ2RKF4871X; Part_type: RESISTORS\FIXED; Project: BSN-II; Customs_HS_Code: 85332119; Custom_Duty: 15%; Voltage: NA; PCB Footprint: RES0402; Tolerance: 1%; Wattage: 1/16W; Package: 0402; Distributor_name: DIGIKEY; Distributor_part_number: P4.87KLCT-ND; Height: 0.40MM; Datasheet: Y:\MIS_DATABASE\DATASHEETS\RESISTORS\PAN-ERJSERIES.PDF; Crtd /date: USMAN/150109; Chkd/date: MAZHAR/150709; Library Ref: RESISTOR; Footprint Ref: RES0402; Weight: 0.8mg; Temperature: -55°C+155°C; Library Path: Y:\MIS_DATABASE\Library\ALTIUM_TOOL\SCHEMATICS_PARTS\MS_DISCRETE_Library.schlib; Footprint Path: Y:\MIS_DATABASE\Library\ALTIUM_TOOL\PCB_FOOTPRINTS\Altium_Footprint_Lib.PcbLib
R654 = RESISTOR_Dup3: as R592 on sheet 25-CURRENT MONITORING DEVICES; PCB Footprint: RES0402; Chkd/date: VASANTHA/130516; Crtd /date: VASANTHA/130516; Datasheet: Y:\MIS_DATABASE\DATASHEETS\RESISTORS\YAGEO-RC0402.PDF; Temperature: -55°C+155°C; Weight: NA; Height: 0.55MM; Distributor_part_number: 311-4.7KJRCT-ND; Distributor_name: DIGIKEY; Package: 0402; Wattage: 1/16W; Tolerance: 5%; Library Ref: RESISTOR
R657 = RESISTOR_Dup5: RES 51E 1/16W 5% 0402; Part_type: RESISTORS\FIXED; Mfr_part_number: ERJ-2GEJ510X; Mfr_name: PANASONIC-ECG; Mistral Part No: 110009030962-R; Custom_Duty: 15%; Customs_HS_Code: 85332119; Project: CTP02_REVA_BASE; PCB Footprint: RES0402; Chkd/date: SHREESHAIL/131205; Crtd /date: MAZHAR/120505; Datasheet: Y:\MIS_DATABASE\DATASHEETS\RESISTORS\ERJ12.PDF; Height: 0.40MM; Distributor_part_number: P51JTR-ND; Distributor_name: DIGIKEY; Package: 0402; Wattage: 1/16W; Tolerance: 5%; Library Ref: RESISTOR
R677 = RESISTOR_Dup5: RES 220K 1/16W 1% 0402; Part_type: RESISTORS\FIXED; Mfr_part_number: CRCW0402220KFKED; Mfr_name: VISHAY; Mistral Part No: 110017080025-R; Custom_Duty: 15%; Customs_HS_Code: 85332119; Voltage: NA; Project: TI_MAXIE_CPB; MECHANICAL 3D STEP FILE: RES0402_0-5; Chkd/date: MANIRAJA/230817; Crtd /date: MANIRAJA/230817; Datasheet: Y:\MIS_DATABASE\DATASHEETS\RESISTORS\CRCW0603.PDF; Temperature: -55°C+155°C; Weight: 0.65mg; Height: 0.40MM; Distributor_part_number: 541-220KLCT-ND; Distributor_name: DIGIKEY; Package: 0402; Wattage: 1/16W; Tolerance: 1%; PCB Footprint: RES0402_0-5; Library Ref: RESISTOR
R678 = RESISTOR_Dup5: RES 330K 1/16W 1% 0402; Part_type: RESISTORS\FIXED; Mfr_part_number: CRCW0402330KFKED; Mfr_name: VISHAY; Mistral Part No: 110017080024-R; Custom_Duty: 15%; Customs_HS_Code: 85332119; Voltage: NA; Project: TI_MAXIE_CPB; MECHANICAL 3D STEP FILE: RES0402_0-5; Chkd/date: MANIRAJA/230817; Crtd /date: MANIRAJA/230817; Datasheet: Y:\MIS_DATABASE\DATASHEETS\RESISTORS\CRCW0603.PDF; Temperature: -55°C+155°C; Weight: 0.65mg; Height: 0.40MM; Distributor_part_number: 541-330KLCT-ND; Distributor_name: DIGIKEY; Package: 0402; Wattage: 1/16W; Tolerance: 1%; PCB Footprint: RES0402_0-5; Library Ref: RESISTOR; Footprint Ref: RES0402_0-5; Library Path: Y:\MIS_DATABASE\Library\ALTIUM_TOOL\SCHEMATICS_PARTS\MS_DISCRETE_Library.schlib; Footprint Path: Y:\MIS_DATABASE\Library\ALTIUM_TOOL\PCB_FOOTPRINTS\Altium_Footprint_Lib.PcbLib
U57 = TPS79601DRBR_SON8: IC 1A HIGH PSRR RF ADJ LDO LINEAR REGULATOR SON8; Mistral Part No: 142009080012-R; Mfr_name: TEXAS INSTRUMENTS; Part_type: ICS\POWER\VOLTAGE REGULATOR; Wattage: NA; Project: DIO_TXRX; Customs_HS_Code: 85423100; Custom_Duty: 15%; Footprint Path: Y:\MIS_DATABASE\Library\ALTIUM_TOOL\PCB_FOOTPRINTS\Altium_Footprint_Lib.PcbLib; Library Path: Y:\MIS_DATABASE\Library\ALTIUM_TOOL\SCHEMATICS_PARTS\MS_MISCPOWER_Library.schlib; MECHANICAL 3D STEP FILE: SON8_25-59_130X130_1; PCB Footprint: SON8_25-59_130X130_1; Voltage: NA; Tolerance: NA; Mfr_part_number: TPS79601DRBR; Package: SON8; Distributor_name: DIGIKEY; Distributor_part_number: 296-23107-1-ND; Height: 1.00MM; Weight: 24mg; Temperature: -40°C+125°C; Datasheet: Y:\MIS_DATABASE\DATASHEETS\MISC\REGULATORS\TPS796XX.PDF; Crtd /date: MAZHAR/280809; Chkd/date: MANIRAJA/030518; Library Ref: TPS79601DRBR_SON8; Footprint Ref: SON8_25-59_130X130_1
U58 = TPD4E004_SON6: IC 4CH ESD-PROT ARRAY SON6; Mistral Part No: 141010020012-P; Mfr_name: TEXAS INSTRUMENTS; Part_type: ICS\INTERFACE; Project: BUG_BASE-II; Customs_HS_Code: 85423100; Custom_Duty: 15%; Library Ref: TPD4E004_SON6; Mfr_part_number: TPD4E004DRYR; Package: SON6; Distributor_name: DIGIKEY; Distributor_part_number: 296-23618-1-ND; Height: 0.60MM; Weight: NA; Temperature: -40°C+85°C; Datasheet: Y:\MIS_DATABASE\DATASHEETS\ICS\INTERFACE\TPD4E004.PDF; Crtd /date: MUDDU/010310; Chkd/date: SUHAS/131210; RoHS: Pb-Free; PCB Footprint: SON6_19-68_60X45
U106 = TM4C1294NCPDTT3R_TQFP128: IC 32-BIT MICROCONTROLLER WITH 1MB FLASH TQFP128; Part_type: ICS\DIGITAL\MICROCONTROLLER; Mfr_name: TEXAS INSTRUMENTS; Mistral Part No: 141217080002-R; Custom_Duty: 15%; Customs_HS_Code: 85423100; Wattage: NA; Project: TI_MAXIE_CPB; MECHANICAL 3D STEP FILE: TQFP128_15-74_550X550_1-2; Chkd/date: MANIRAJA/220817; Crtd /date: MANIRAJA/220817; Datasheet: Y:\MIS_DATABASE\DATASHEETS\ICS\DIGITAL\MICROCONTROLLER\TM4C1294NCPD.PDF; Temperature: -40°C+105°C; Weight: 503.5mg; Height: 1.20MM; Distributor_part_number: TM4C1294NCPDTT3R-ND; Distributor_name: DIGIKEY; Package: TQF9128; Voltage: NA; Tolerance: NA; Mfr_part_number: TM4C1294NCPDTT3R; PCB Footprint: TQFP128_15-74_550X550_1-2; Library Ref: TM4C1294NCPDTT3R_TQFP128
U107 = LM4040B25IDCKR_SC70-5: IC PRECISION MICROPOWER SHUNT VOLTAGE REFERENCE SC70-5; Part_type: ICS\POWER\VOLTAGE REGULATOR; Mfr_name: TEXAS INSTRUMENTS; Mistral Part No: 142017080015-R; Custom_Duty: 15%; Customs_HS_Code: 85423100; Wattage: NA; Project: TI_MAXIE_CPB; PCB Footprint: SC70-5_1-1; MECHANICAL 3D STEP FILE: SC70-5_1-1; Chkd/date: MANIRAJA/230817; Crtd /date: MANIRAJA/230817; Datasheet: Y:\MIS_DATABASE\DATASHEETS\ICS\POWER\LM4040B25I.PDF; Temperature: -40°C+85°C; Weight: 30mg; Height: 1.10MM; Distributor_part_number: 296-20873-1-ND; Distributor_name: DIGIKEY; Package: SC70-5; Voltage: NA; Tolerance: NA; Mfr_part_number: LM4040B25IDCKR; Library Ref: LM4040B25IDCKR_SC70-5
Y6 = CRY4_13: CRY 16.000MHz SMD; Mistral Part No: 130017080024-R; Mfr_name: NDK; Mfr_part_number: NX3225GA-16.000M-STD-CRG-1; Part_type: CRYSTAL; Project: TI_MAXIE_CPB; Tolerance: NA; Customs_HS_Code: 85439000; Custom_Duty: 24%; PCB Footprint: XTAL4_NX3225GA_130X100_SMD_0-9; Voltage: NA; Wattage: NA; Package: SMD; Distributor_name: DIGIKEY; Distributor_part_number: 644-1157-1-ND; Height: 0.90MM; Weight: NA; Temperature: -40°C+85°C; Datasheet: Y:\MIS_DATABASE\DATASHEETS\MISC\CRY_OSC\NX3225GA.PDF; Crtd /date: MANIRAJA/230817; Chkd/date: MANIRAJA/230817; MECHANICAL 3D STEP FILE: XTAL4_NX3225GA_130X100_SMD_0-9; Library Ref: CRY4_13

## Sheet 27-JTAG BUFFER.SchDoc
size 513 x 386 mm
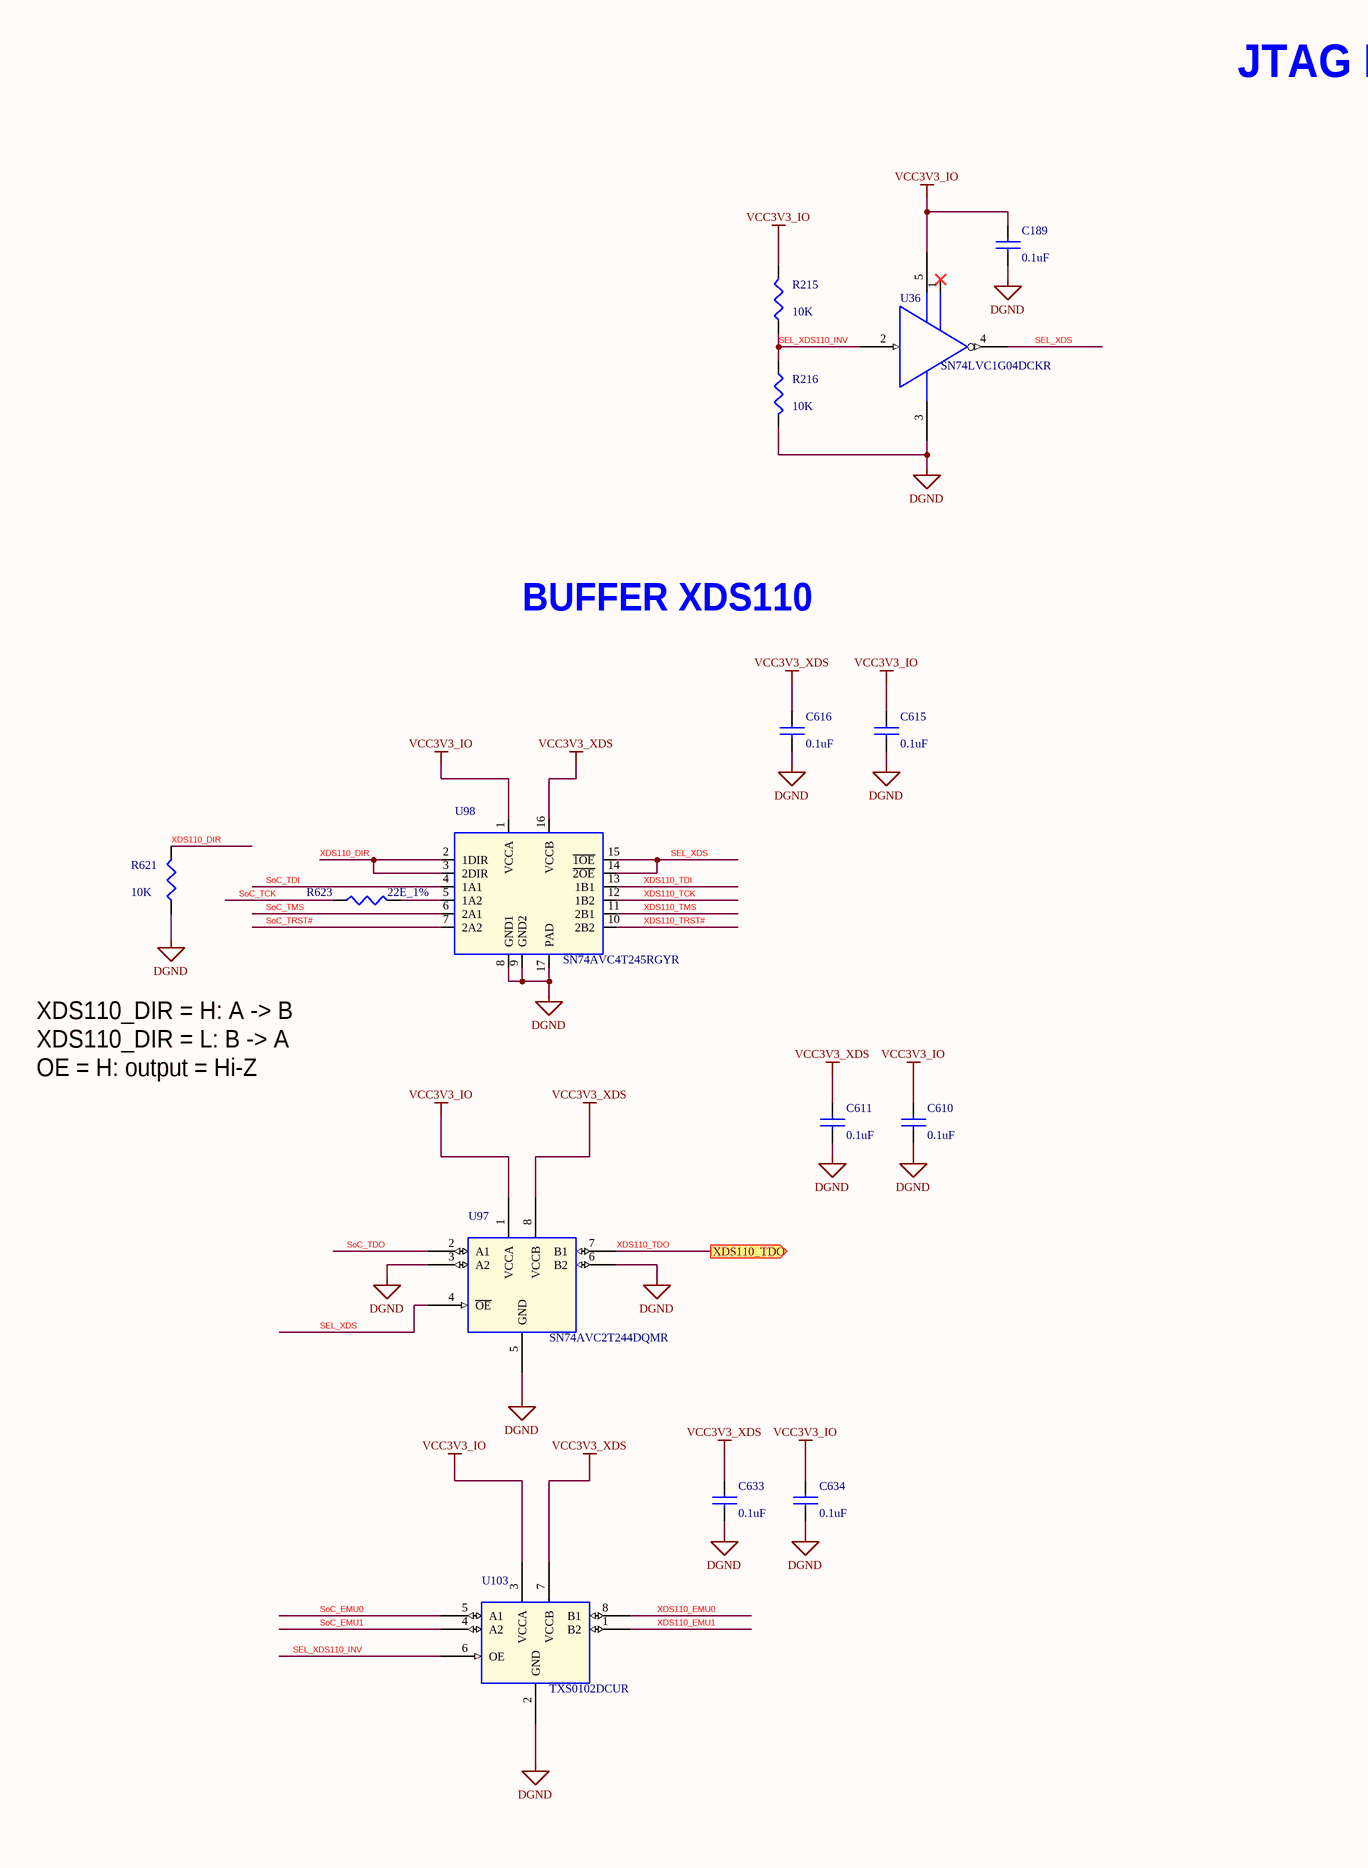
[diagram p46: 27-JTAG BUFFER.SchDoc, left]
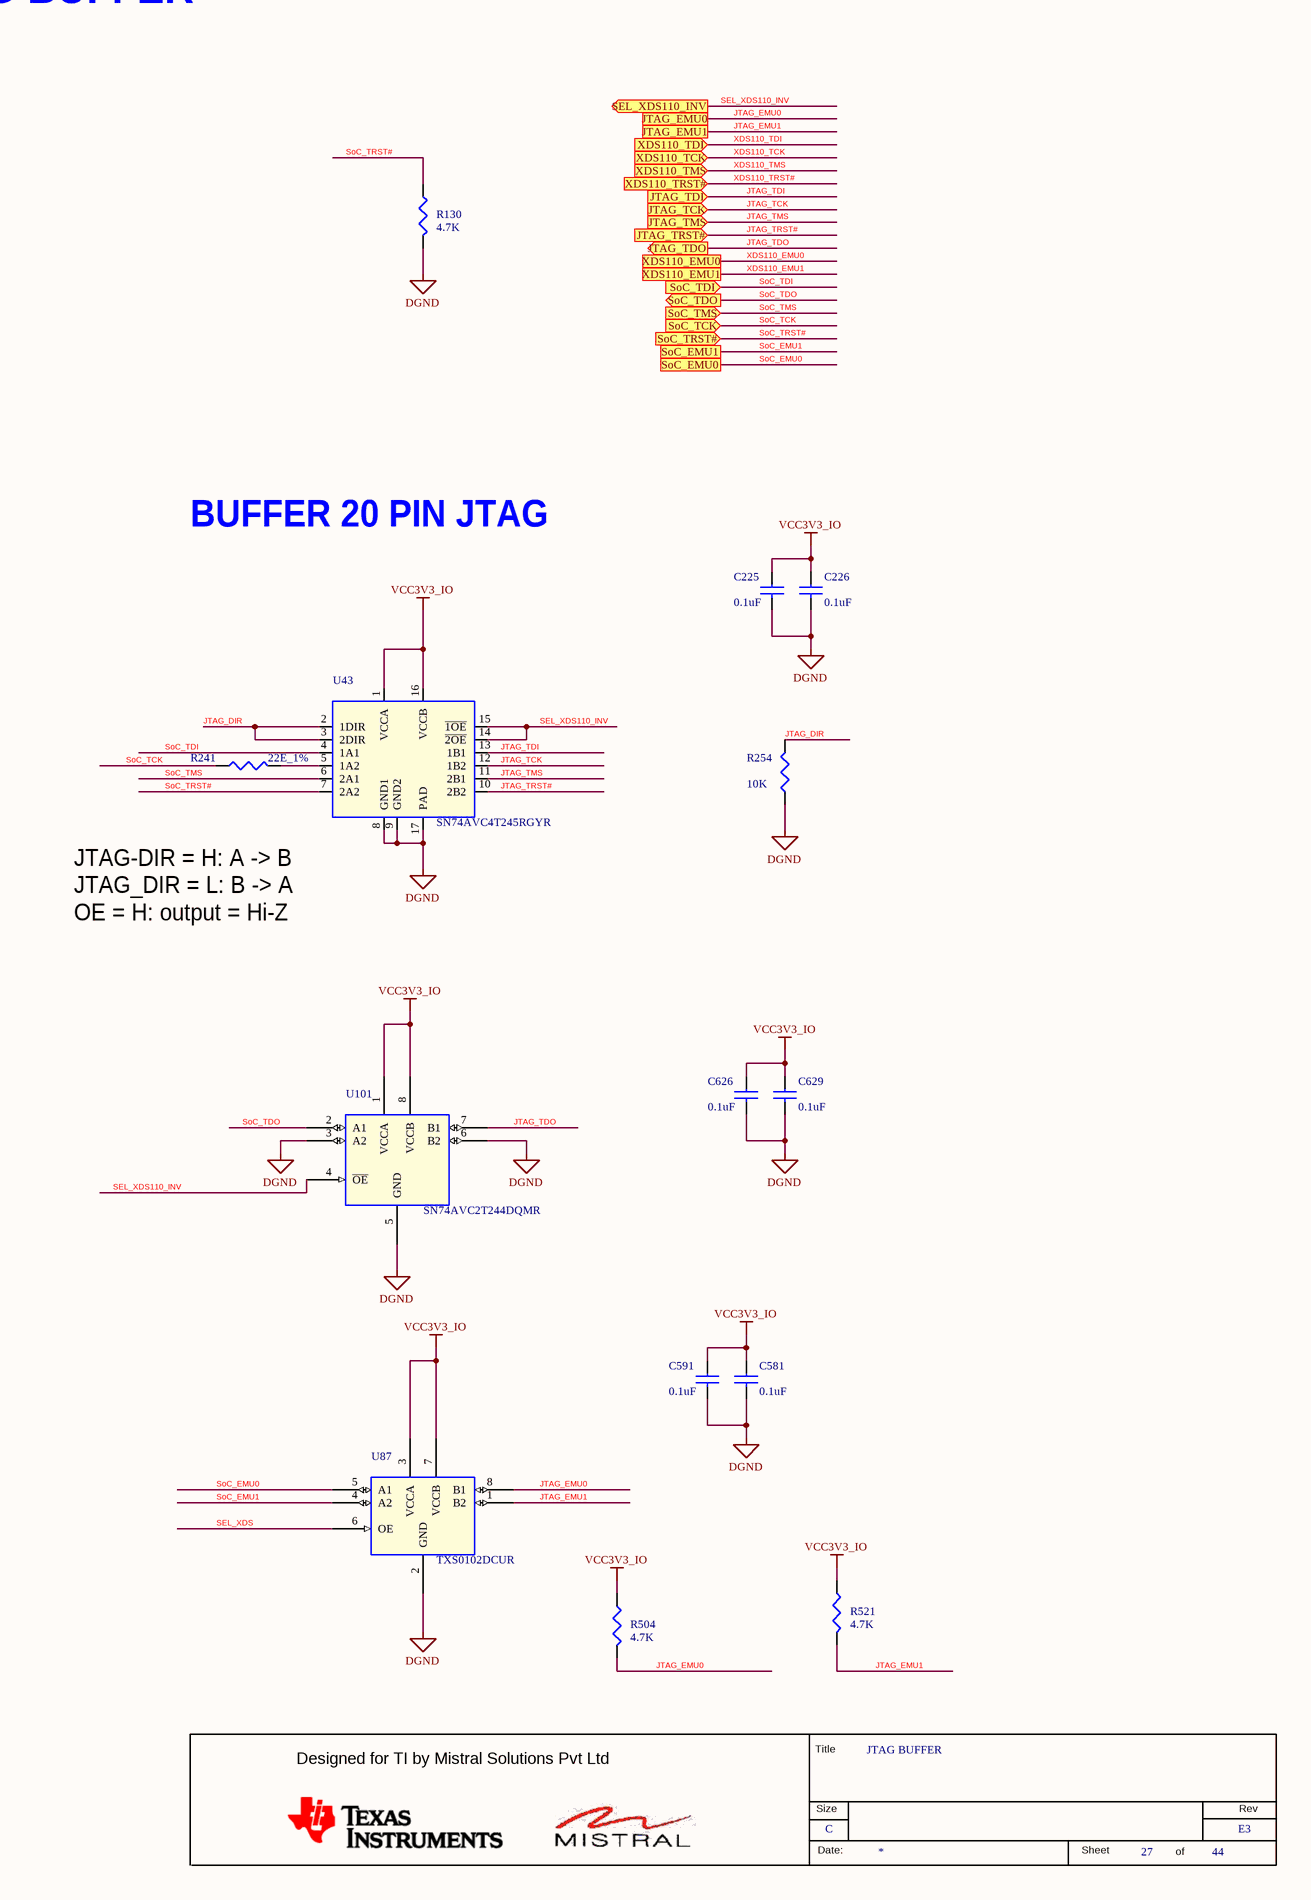
[diagram p47: 27-JTAG BUFFER.SchDoc, right]

### Parts
(Parts that share a designator on the sheet are numbered #1, #2 ... from top to bottom, then left to right.)
*#27  RevCode: E3  Title: JTAG BUFFER  Page Size: C  Page Number: 27  Page Count: 44  (hidden comment: MISTRAL_TITLEBLK_CSIZE)  (graphical)
C189  0.1uF  [CAP0201_0-5]
C225  0.1uF  [CAP0201_0-5]
C226  0.1uF  [CAP0201_0-5]
C581  0.1uF  [CAP0201_0-5]
C591  0.1uF  [CAP0201_0-5]
C610  0.1uF  [CAP0201_0-5]
C611  0.1uF  [CAP0201_0-5]
C615  0.1uF  [CAP0201_0-5]
C616  0.1uF  [CAP0201_0-5]
C626  0.1uF  [CAP0201_0-5]
C629  0.1uF  [CAP0201_0-5]
C633  0.1uF  [CAP0201_0-5]
C634  0.1uF  [CAP0201_0-5]
R130  4.7K  [RES0402]
R215  10K  [RES0402_0-5]
R216  10K  [RES0402_0-5]
R241  22E_1%  [RES0402]
R254  10K  [RES0402_0-5]
R504  4.7K  [RES0402]
R521  4.7K  [RES0402]
R621  10K  [RES0402_0-5]
R623  22E_1%  [RES0402]
U36  SN74LVC1G04DCKR  [SC70-5]
U43  SN74AVC4T245RGYR  [QFN16_19-68_160X140]
U87  TXS0102DCUR  [VSSOP8_19-68_85X95_0-9]
U97  SN74AVC2T244DQMR  [X2SON8_15-74_70X50]
U98  SN74AVC4T245RGYR  [QFN16_19-68_160X140]
U101  SN74AVC2T244DQMR  [X2SON8_15-74_70X50]
U103  TXS0102DCUR  [VSSOP8_19-68_85X95_0-9]

### Ports
JTAG_EMU0, JTAG_EMU1, JTAG_TCK (in), JTAG_TDI (in), JTAG_TDO (out), JTAG_TMS (in), JTAG_TRST# (in), SEL_XDS110_INV (out), SoC_EMU0, SoC_EMU1, SoC_TCK (in), SoC_TDI (in), SoC_TDO (out), SoC_TMS (in), SoC_TRST# (in), XDS110_EMU0, XDS110_EMU1, XDS110_TCK (in), XDS110_TDI (in), XDS110_TDO (out), XDS110_TMS (in), XDS110_TRST# (in)

### Nets
DGND: C189.2 C225.2 C226.2 C581.2 C591.2 C610.2 C611.2 C615.2 C616.2 C626.2 C629.2 C633.2 C634.2 R130.2 R216.2 R254.1 R621.1 U36.3(GND) U43.8(GND1) U43.9(GND2) U43.17(PAD) U87.2(GND) U97.3(A2) U97.5(GND) U97.6(B2) U98.8(GND1) U98.9(GND2) U98.17(PAD) U101.3(A2) U101.5(GND) U101.6(B2) U103.2(GND)
VCC3V3_IO: C189.1 C225.1 C226.1 C581.1 C591.1 C610.1 C615.1 C626.1 C629.1 C634.1 R215.2 R504.1 R521.1 U36.5(VCC) U43.1(VCCA) U43.16(VCCB) U87.3(VCCA) U87.7(VCCB) U97.1(VCCA) U98.1(VCCA) U101.1(VCCA) U101.8(VCCB) U103.3(VCCA)
VCC3V3_XDS: C611.1 C616.1 C633.1 U97.8(VCCB) U98.16(VCCB) U103.7(VCCB)
JTAG_DIR: R254.2 U43.2(1DIR) U43.3(2DIR)
JTAG_EMU0: R504.2 U87.8(B1) ; port JTAG_EMU0
JTAG_EMU1: R521.2 U87.1(B2) ; port JTAG_EMU1
JTAG_TCK: U43.12(1B2) ; port JTAG_TCK
JTAG_TDI: U43.13(1B1) ; port JTAG_TDI
JTAG_TDO: U101.7(B1) ; port JTAG_TDO
JTAG_TMS: U43.11(2B1) ; port JTAG_TMS
JTAG_TRST#: U43.10(2B2) ; port JTAG_TRST#
SEL_XDS: U36.4(Y) U87.6(OE) U97.4(~{OE}) U98.14(~{2OE}) U98.15(~{1OE})
SEL_XDS110_INV: R215.1 R216.1 U36.2(A) U43.14(~{2OE}) U43.15(~{1OE}) U101.4(~{OE}) U103.6(OE) ; port SEL_XDS110_INV
SoC_EMU0: U87.5(A1) U103.5(A1) ; port SoC_EMU0
SoC_EMU1: U87.4(A2) U103.4(A2) ; port SoC_EMU1
SoC_TCK: R241.2 R623.2 ; port SoC_TCK
SoC_TDI: U43.4(1A1) U98.4(1A1) ; port SoC_TDI
SoC_TDO: U97.2(A1) U101.2(A1) ; port SoC_TDO
SoC_TMS: U43.6(2A1) U98.6(2A1) ; port SoC_TMS
SoC_TRST#: R130.1 U43.7(2A2) U98.7(2A2) ; port SoC_TRST#
XDS110_DIR: R621.2 U98.2(1DIR) U98.3(2DIR)
XDS110_EMU0: U103.8(B1) ; port XDS110_EMU0
XDS110_EMU1: U103.1(B2) ; port XDS110_EMU1
XDS110_TCK: U98.12(1B2) ; port XDS110_TCK
XDS110_TDI: U98.13(1B1) ; port XDS110_TDI
XDS110_TDO: U97.7(B1) ; port XDS110_TDO
XDS110_TMS: U98.11(2B1) ; port XDS110_TMS
XDS110_TRST#: U98.10(2B2) ; port XDS110_TRST#
NetR241_1: R241.1 U43.5(1A2)
NetR623_1: R623.1 U98.5(1A2)

Not connected (* = marked no-connect by the designer): U36 1(NC)*

### Notes on the sheet
- JTAG BUFFER
- BUFFER XDS110
- BUFFER 20 PIN JTAG
- (near U43) JTAG-DIR = H: A -> B
  JTAG_DIR = L: B -> A
  OE = H: output = Hi-Z
- XDS110_DIR = H: A -> B
  XDS110_DIR = L: B -> A
  OE = H: output = Hi-Z
- (in symbol MISTRAL_TITLEBLK_CSIZE) Title; Designed for TI by Mistral Solutions Pvt Ltd; Size; Rev; Date:; Sheet; of

### Library data of the parts
*#27 = MISTRAL_TITLEBLK_CSIZE: Issue: 1.0; Page Create Date: March  8, 1995; Page Modify Date: *
C189 C226 C581 C615 C629 = CAP_Dup5: as C613 on sheet 24-BOOT MODE BUFFER AND SWITCHES; Library Ref: CAP; PCB Footprint: CAP0201_0-5; MECHANICAL 3D STEP FILE: CAP0201_0-5; Chkd/date: MANIRAJA/120218; Crtd /date: MANIRAJA/120218; Datasheet: Y:\MIS_DATABASE\DATASHEETS\CAPACITORS\GRM033R61C104KE84.PDF; Temperature: -55°C+85°C; Weight: 0.33mg; Height: 0.33MM; Distributor_part_number: 490-16742-1-ND; Distributor_name: DIGIKEY; Package: 0201; Voltage: 16V; Tolerance: 10%
C225 C591 C610 C611 C616 C626 C633 C634 = CAP_Dup5: as C614 on sheet 24-BOOT MODE BUFFER AND SWITCHES; Library Ref: CAP; PCB Footprint: CAP0201_0-5; Tolerance: 10%; Voltage: 16V; Package: 0201; Distributor_name: DIGIKEY; Distributor_part_number: 490-16742-1-ND; Height: 0.33MM; Weight: 0.33mg; Temperature: -55°C+85°C; Datasheet: Y:\MIS_DATABASE\DATASHEETS\CAPACITORS\GRM033R61C104KE84.PDF; Crtd /date: MANIRAJA/120218; Chkd/date: MANIRAJA/120218; MECHANICAL 3D STEP FILE: CAP0201_0-5
R130 R504 R521 = RESISTOR_Dup3: as R592 on sheet 25-CURRENT MONITORING DEVICES; Library Ref: RESISTOR; PCB Footprint: RES0402; Chkd/date: VASANTHA/130516; Crtd /date: VASANTHA/130516; Datasheet: Y:\MIS_DATABASE\DATASHEETS\RESISTORS\YAGEO-RC0402.PDF; Temperature: -55°C+155°C; Weight: NA; Height: 0.55MM; Distributor_part_number: 311-4.7KJRCT-ND; Distributor_name: DIGIKEY; Package: 0402; Wattage: 1/16W; Tolerance: 5%
R215 R254 R621 = RESISTOR_Dup5: as R82 on sheet 24-BOOT MODE BUFFER AND SWITCHES; Footprint Path: Y:\MIS_DATABASE\Library\ALTIUM_TOOL\PCB_FOOTPRINTS\Altium_Footprint_Lib.PcbLib; Library Path: Y:\MIS_DATABASE\Library\ALTIUM_TOOL\SCHEMATICS_PARTS\MS_DISCRETE_Library.schlib; Footprint Ref: RES0402_0-5; Library Ref: RESISTOR; PCB Footprint: RES0402_0-5; Tolerance: 5%; Wattage: 1/16W; Package: 0402; Distributor_name: DIGIKEY; Distributor_part_number: 311-10KJRCT-ND; Height: 0.40MM; Weight: 0.65mg; Temperature: -55°C+155°C; Datasheet: Y:\MIS_DATABASE\DATASHEETS\RESISTORS\YAGEO-RC0402.PDF; Crtd /date: MAZHAR/230805; Chkd/date: VASANTHA/061216; RoHS: Pb-Free; MECHANICAL 3D STEP FILE: RES0402_0-5
R216 = RESISTOR_Dup5: as R81 on sheet 24-BOOT MODE BUFFER AND SWITCHES; Footprint Path: Y:\MIS_DATABASE\Library\ALTIUM_TOOL\PCB_FOOTPRINTS\Altium_Footprint_Lib.PcbLib; Library Path: Y:\MIS_DATABASE\Library\ALTIUM_TOOL\SCHEMATICS_PARTS\MS_DISCRETE_Library.schlib; Footprint Ref: RES0402_0-5; Library Ref: RESISTOR; Tolerance: 5%; Wattage: 1/16W; Package: 0402; Distributor_name: DIGIKEY; Distributor_part_number: 311-10KJRCT-ND; Height: 0.40MM; Weight: 0.65mg; Temperature: -55°C+155°C; Datasheet: Y:\MIS_DATABASE\DATASHEETS\RESISTORS\YAGEO-RC0402.PDF; Crtd /date: MAZHAR/230805; Chkd/date: VASANTHA/061216; RoHS: Pb-Free; MECHANICAL 3D STEP FILE: RES0402_0-5; PCB Footprint: RES0402_0-5
R241 = RESISTOR_Dup4: RES 22E 1/16W 1% 0402; Mistral Part No: 110009090004-P; Mfr_name: YAGEO AMERICA; Mfr_part_number: RC0402FR-0722RL; Part_type: RESISTORS\FIXED; Alternate_mfr_name_A: VISHAY; Alternate_mfr_part_number_A: CRCW040222R0FKED; Cust_part_number: 4700-80047E; SIGNAL_MODEL: RESISTOR_RES0402_22E_22E; Project: VMEFMCD; Voltage: 50V; Customs_HS_Code: 85332119; Custom_Duty: 15%; Remarks: In alternate datasheet it is RoHS COMPLIANT. Y:\MIS_DATABASE\DATASHEETS\RESISTORS\CRCW0402.PDF; Library Ref: RESISTOR; Tolerance: 1%; Wattage: 1/16W; Package: 0402; Distributor_name: DIGIKEY; Distributor_part_number: 311-22.0LRCT-ND; Distributor_name_A: DIGIKEY; Distributor_part_number_A: 541-22.0LCT-ND; Height: 0.40MM; Weight: 0.8g/1000pcs; Temperature: -55°C+155°C; Datasheet: Y:\MIS_DATABASE\DATASHEETS\RESISTORS\YAGEO-RC0402.PDF; Crtd /date: MAZHAR/090909; Chkd/date: SUHAS/290910; RoHS: Pb-Free; PCB Footprint: RES0402
R623 = RESISTOR_Dup4: RES 22E 1/16W 1% 0402; Cust_part_number: 4700-80047E; Alternate_mfr_part_number_A: CRCW040222R0FKED; Alternate_mfr_name_A: VISHAY; Part_type: RESISTORS\FIXED; Mfr_part_number: RC0402FR-0722RL; Mfr_name: YAGEO AMERICA; Mistral Part No: 110009090004-P; Remarks: In alternate datasheet it is RoHS COMPLIANT. Y:\MIS_DATABASE\DATASHEETS\RESISTORS\CRCW0402.PDF; Custom_Duty: 15%; Customs_HS_Code: 85332119; Voltage: 50V; Project: VMEFMCD; SIGNAL_MODEL: RESISTOR_RES0402_22E_22E; Library Ref: RESISTOR; RoHS: Pb-Free; Chkd/date: SUHAS/290910; Crtd /date: MAZHAR/090909; Datasheet: Y:\MIS_DATABASE\DATASHEETS\RESISTORS\YAGEO-RC0402.PDF; Temperature: -55°C+155°C; Weight: 0.8g/1000pcs; Height: 0.40MM; Distributor_part_number_A: 541-22.0LCT-ND; Distributor_name_A: DIGIKEY; Distributor_part_number: 311-22.0LRCT-ND; Distributor_name: DIGIKEY; Package: 0402; Wattage: 1/16W; Tolerance: 1%; PCB Footprint: RES0402
U36 = SN74LVC1G04DCKR_SC70-5: IC SINGLE INVERTER GATE SC70-5; Mistral Part No: 141009070007-R; Mfr_name: TEXAS INSTRUMENTS; Part_type: ICS\DIGITAL\GATES; Project: BUG_BASE-II; Customs_HS_Code: 85423100; Custom_Duty: 15%; Library Ref: SN74LVC1G04DCKR_SC70-5; PCB Footprint: SC70-5; Mfr_part_number: SN74LVC1G04DCKR; Package: SC70-5; Distributor_name: DIGIKEY; Distributor_part_number: 296-11600-1-ND; Height: 1.10MM; Temperature: -40°C+85°C; Datasheet: Y:\MIS_DATABASE\DATASHEETS\ICS\DIGITAL\GATES\SN74LVC1G04-1.PDF; Crtd /date: USMAN/150709; Chkd/date: SUHAS/221010; RoHS: Sb/ Br FREE
U43 = SN74AVC4T245RGYR_QFN16: IC 4-BIT DUAL SUPPLY BUS TRANSCEIVER QFN16; Part_type: ICS\DIGITAL\COMBINATIONAL; Mfr_name: TEXAS INSTRUMENTS; Mistral Part No: 141009030112-R; Custom_Duty: 15%; Customs_HS_Code: 85423100; Project: HS100RD; Library Ref: SN74AVC4T245RGYR_QFN16; PCB Footprint: QFN16_19-68_160X140; RoHS: Sb/ Br FREE; Chkd/date: MAZHAR/060308; Crtd /date: USMAN/060308; Datasheet: Y:\MIS_DATABASE\DATASHEETS\ICS\DIGITAL\BUSTRANSCEIVER\SN74AVC4T245XXXX.PDF; Height: 1.00MM; Distributor_part_number: 296-18231-1-ND; Distributor_name: DIGIKEY; Package: QFN16; Mfr_part_number: SN74AVC4T245RGYR
U87 = TXS0102DCUR_VSSOP8: IC 2BIT BI-DIR VOLTAGE-LEVEL TRANSLATOR US8(VSSOP8); Part_type: ICS\INTERFACE\LEVEL TRANSLATOR; Mfr_name: TEXAS INSTRUMENTS; Mistral Part No: 141009030376-R; Custom_Duty: 15%; Customs_HS_Code: 85423100; Wattage: NA; Project: SD_WATERLOO; Footprint Ref: VSSOP8_19-68_85X95_0-9; Library Ref: TXS0102DCUR_VSSOP8; PCB Footprint: VSSOP8_19-68_85X95_0-9; Footprint Path: Y:\MIS_DATABASE\Library\ALTIUM_TOOL\PCB_FOOTPRINTS\Altium_Footprint_Lib.PcbLib; Library Path: Y:\MIS_DATABASE\Library\ALTIUM_TOOL\SCHEMATICS_PARTS\MS_MISCINTERFACE_Library.schlib; MECHANICAL 3D STEP FILE: VSSOP8_19-68_85X95_0-9; Chkd/date: MANIRAJA/130617; Crtd /date: SHREESHAIL/190108; Datasheet: Y:\MIS_DATABASE\DATASHEETS\ICS\INTERFACE\TXS0102.PDF; Temperature: -40°C+85°C; Weight: 9.6mg; Height: 0.90MM; Distributor_part_number: 296-21931-1-ND; Distributor_name: DIGIKEY; Package: US8; Voltage: NA; Tolerance: NA; Mfr_part_number: TXS0102DCUR
U97 U101 = SN74AVC2T244DQMR_X2SON8: IC 2-BIT UNDIRECTIONAL VOLTAGE-LEVEL TRANSLATOR X2SON8; Mistral Part No: 141016030002-R; Mfr_name: TEXAS INSTRUMENTS; Part_type: ICS\INTERFACE\LEVEL TRANSLATOR; Project: OCTASIC_3600; Tolerance: NA; Pb-Free: 85423100; Customs_HS_Code: 15%; Library Ref: SN74AVC2T244DQMR_X2SON8; PCB Footprint: X2SON8_15-74_70X50; Mfr_part_number: SN74AVC2T244DQMR; Voltage: NA; Wattage: NA; Package: X2SON8; Distributor_name: DIGIKEY; Distributor_part_number: 296-29674-1-ND; Height: 0.40MM; Weight: NA; Temperature: -40°C+85°C; Datasheet: Y:\MIS_DATABASE\DATASHEETS\ICS\INTERFACE\SN74AVC2T244.PDF; Crtd /date: VASANTHA/030316; Chkd/date: VASANTHA/060516
U98 = SN74AVC4T245RGYR_QFN16: as U95 on sheet 24-BOOT MODE BUFFER AND SWITCHES; Library Ref: SN74AVC4T245RGYR_QFN16; PCB Footprint: QFN16_19-68_160X140; Mfr_part_number: SN74AVC4T245RGYR; Package: QFN16; Distributor_name: DIGIKEY; Distributor_part_number: 296-18231-1-ND; Height: 1.00MM; Datasheet: Y:\MIS_DATABASE\DATASHEETS\ICS\DIGITAL\BUSTRANSCEIVER\SN74AVC4T245XXXX.PDF; Crtd /date: USMAN/060308; Chkd/date: MAZHAR/060308; RoHS: Sb/ Br FREE
U103 = TXS0102DCUR_VSSOP8: IC 2BIT BI-DIR VOLTAGE-LEVEL TRANSLATOR US8(VSSOP8); Mistral Part No: 141009030376-R; Mfr_name: TEXAS INSTRUMENTS; Part_type: ICS\INTERFACE\LEVEL TRANSLATOR; Project: SD_WATERLOO; Tolerance: NA; Customs_HS_Code: 85423100; Custom_Duty: 15%; Footprint Ref: VSSOP8_19-68_85X95_0-9; Library Ref: TXS0102DCUR_VSSOP8; PCB Footprint: VSSOP8_19-68_85X95_0-9; Mfr_part_number: TXS0102DCUR; Voltage: NA; Wattage: NA; Package: US8; Distributor_name: DIGIKEY; Distributor_part_number: 296-21931-1-ND; Height: 0.90MM; Weight: 9.6mg; Temperature: -40°C+85°C; Datasheet: Y:\MIS_DATABASE\DATASHEETS\ICS\INTERFACE\TXS0102.PDF; Crtd /date: SHREESHAIL/190108; Chkd/date: MANIRAJA/130617; MECHANICAL 3D STEP FILE: VSSOP8_19-68_85X95_0-9; Library Path: Y:\MIS_DATABASE\Library\ALTIUM_TOOL\SCHEMATICS_PARTS\MS_MISCINTERFACE_Library.schlib; Footprint Path: Y:\MIS_DATABASE\Library\ALTIUM_TOOL\PCB_FOOTPRINTS\Altium_Footprint_Lib.PcbLib